# EAGLE design control_board (EAGLE 7.6.0)

## Sheet 1 of 6: Power
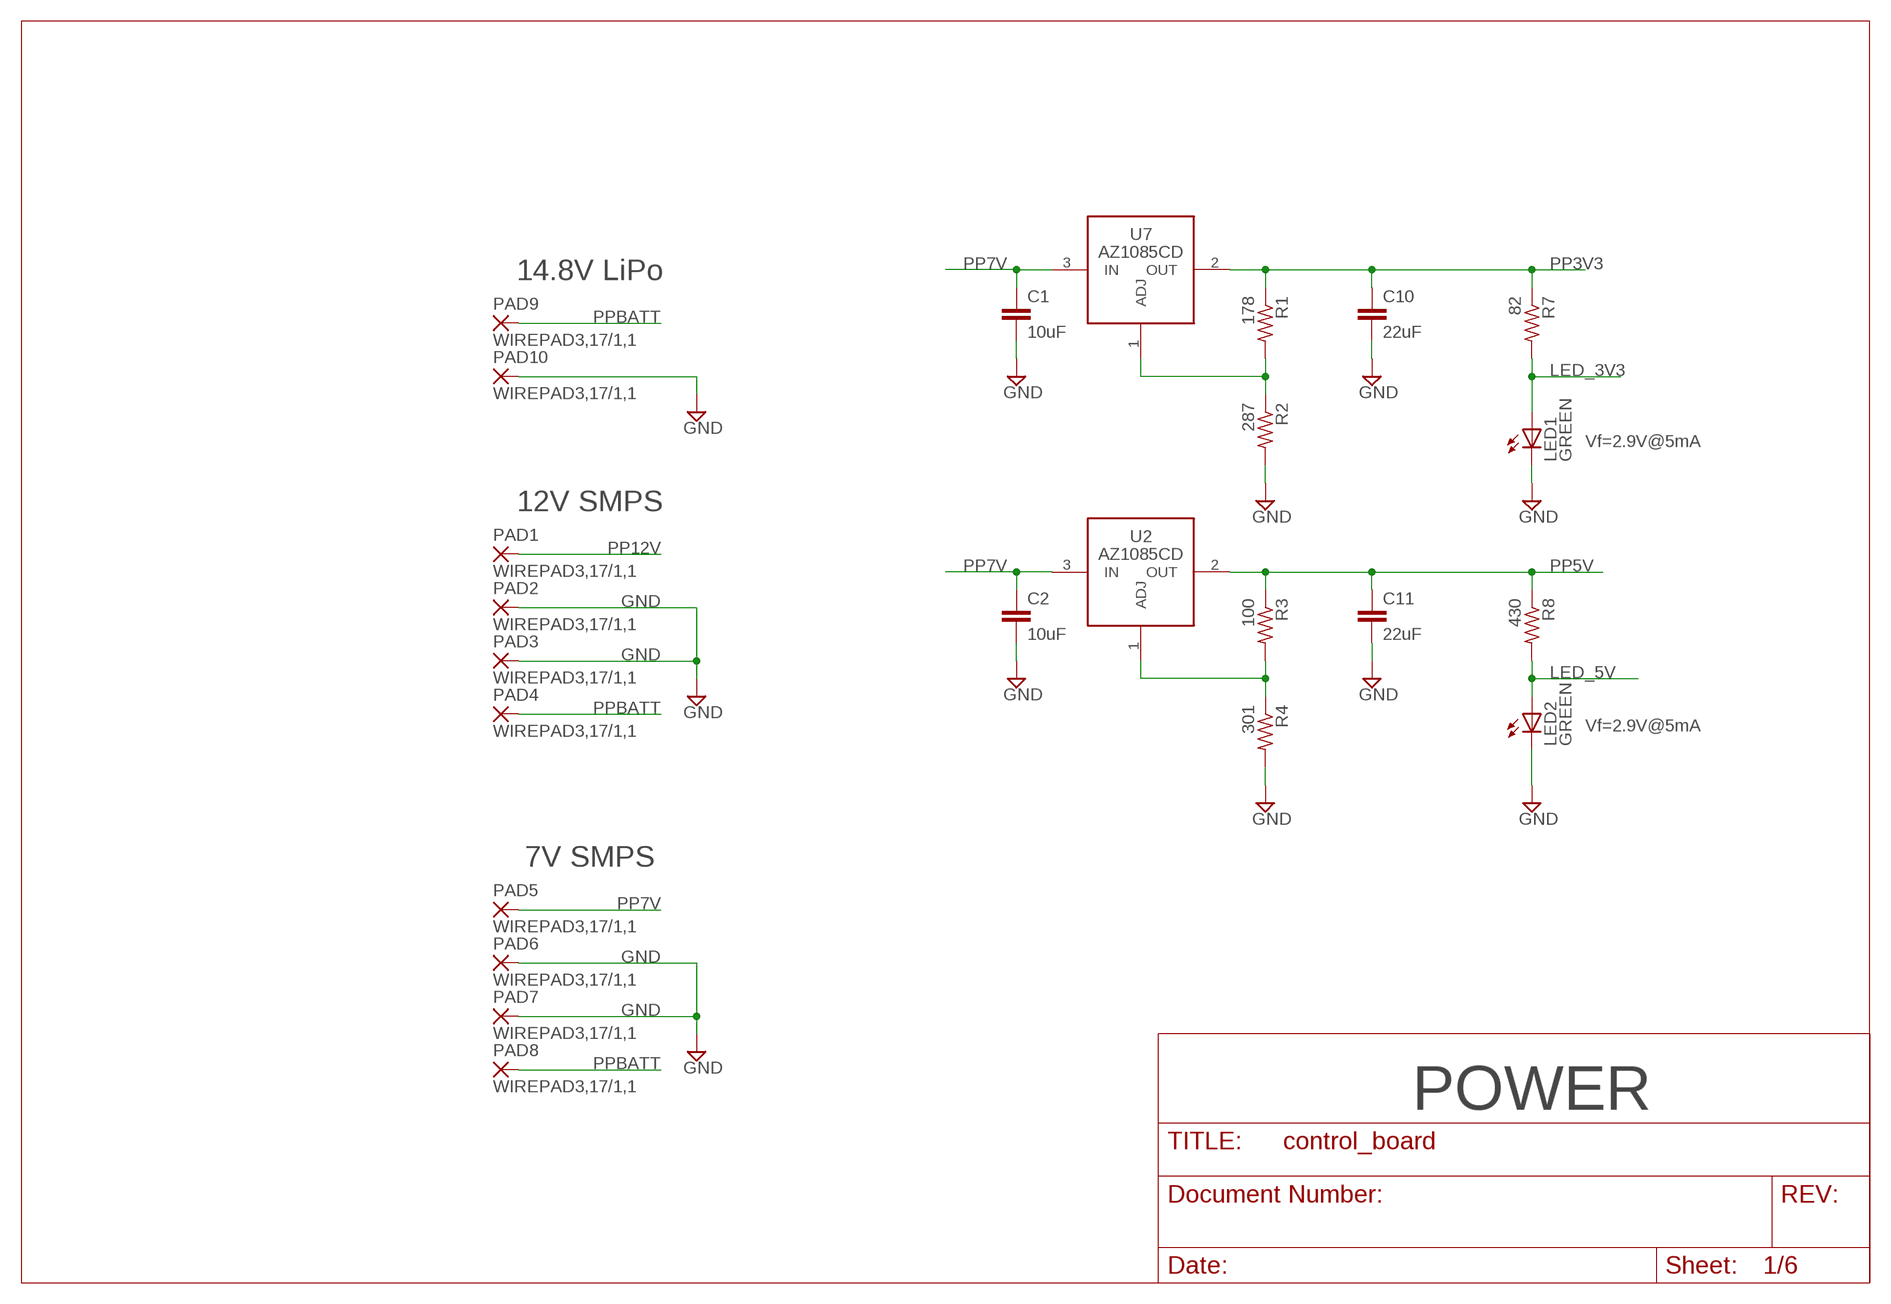
[diagram p0: schematic, sheet 1]

### Parts
C1  10uF  C-EUC0603  [C0603]
C2  10uF  C-EUC0603  [C0603]
C10  22uF  C-EUC0603  [C0603]
C11  22uF  C-EUC0603  [C0603]
LED1  GREEN  LEDCHIPLED_0805  [CHIPLED_0805]
LED2  GREEN  LEDCHIPLED_0805  [CHIPLED_0805]
PAD1  WIREPAD3,17/1,1  [3,17/1,1]
PAD2  WIREPAD3,17/1,1  [3,17/1,1]
PAD3  WIREPAD3,17/1,1  [3,17/1,1]
PAD4  WIREPAD3,17/1,1  [3,17/1,1]
PAD5  WIREPAD3,17/1,1  [3,17/1,1]
PAD6  WIREPAD3,17/1,1  [3,17/1,1]
PAD7  WIREPAD3,17/1,1  [3,17/1,1]
PAD8  WIREPAD3,17/1,1  [3,17/1,1]
PAD9  WIREPAD3,17/1,1  [3,17/1,1]
PAD10  WIREPAD3,17/1,1  [3,17/1,1]
R1  178  R-US_R0603  [R0603]
R2  287  R-US_R0603  [R0603]
R3  100  R-US_R0603  [R0603]
R4  301  R-US_R0603  [R0603]
R7  82  R-US_R0603  [R0603]
R8  430  R-US_R0603  [R0603]
U2  AZ1085CD  AZ1085C  [TO252]
U7  AZ1085CD  AZ1085C  [TO252]

### Nets
GND: C1.2 C2.2 C10.2 C11.2 LED1.C LED2.C PAD2.1(P) PAD3.1(P) PAD6.1(P) PAD7.1(P) PAD10.1(P) R2.2 R4.2 ; also sheet 2,3,4,5,6
LED_3V3: LED1.A R7.2
LED_5V: LED2.A R8.2
N$1: R3.2 R4.1 U2.1(ADJ)
N$3: R1.2 R2.1 U7.1(ADJ)
PP3V3: C10.1 R1.1 R7.1 U7.2(OUT) ; also sheet 3,4,5
PP5V: C11.1 R3.1 R8.1 U2.2(OUT) ; also sheet 3,6
PP7V: C1.1 C2.1 PAD5.1(P) U2.3(IN) U7.3(IN) ; also sheet 2
PP12V: PAD1.1(P) ; also sheet 6
PPBATT: PAD4.1(P) PAD8.1(P) PAD9.1(P)

### Notes on the sheet
- 14.8V LiPo
- Vf=2.9V@5mA
- 12V SMPS
- Vf=2.9V@5mA
- 7V SMPS
- POWER

## Sheet 2 of 6: Nucleo
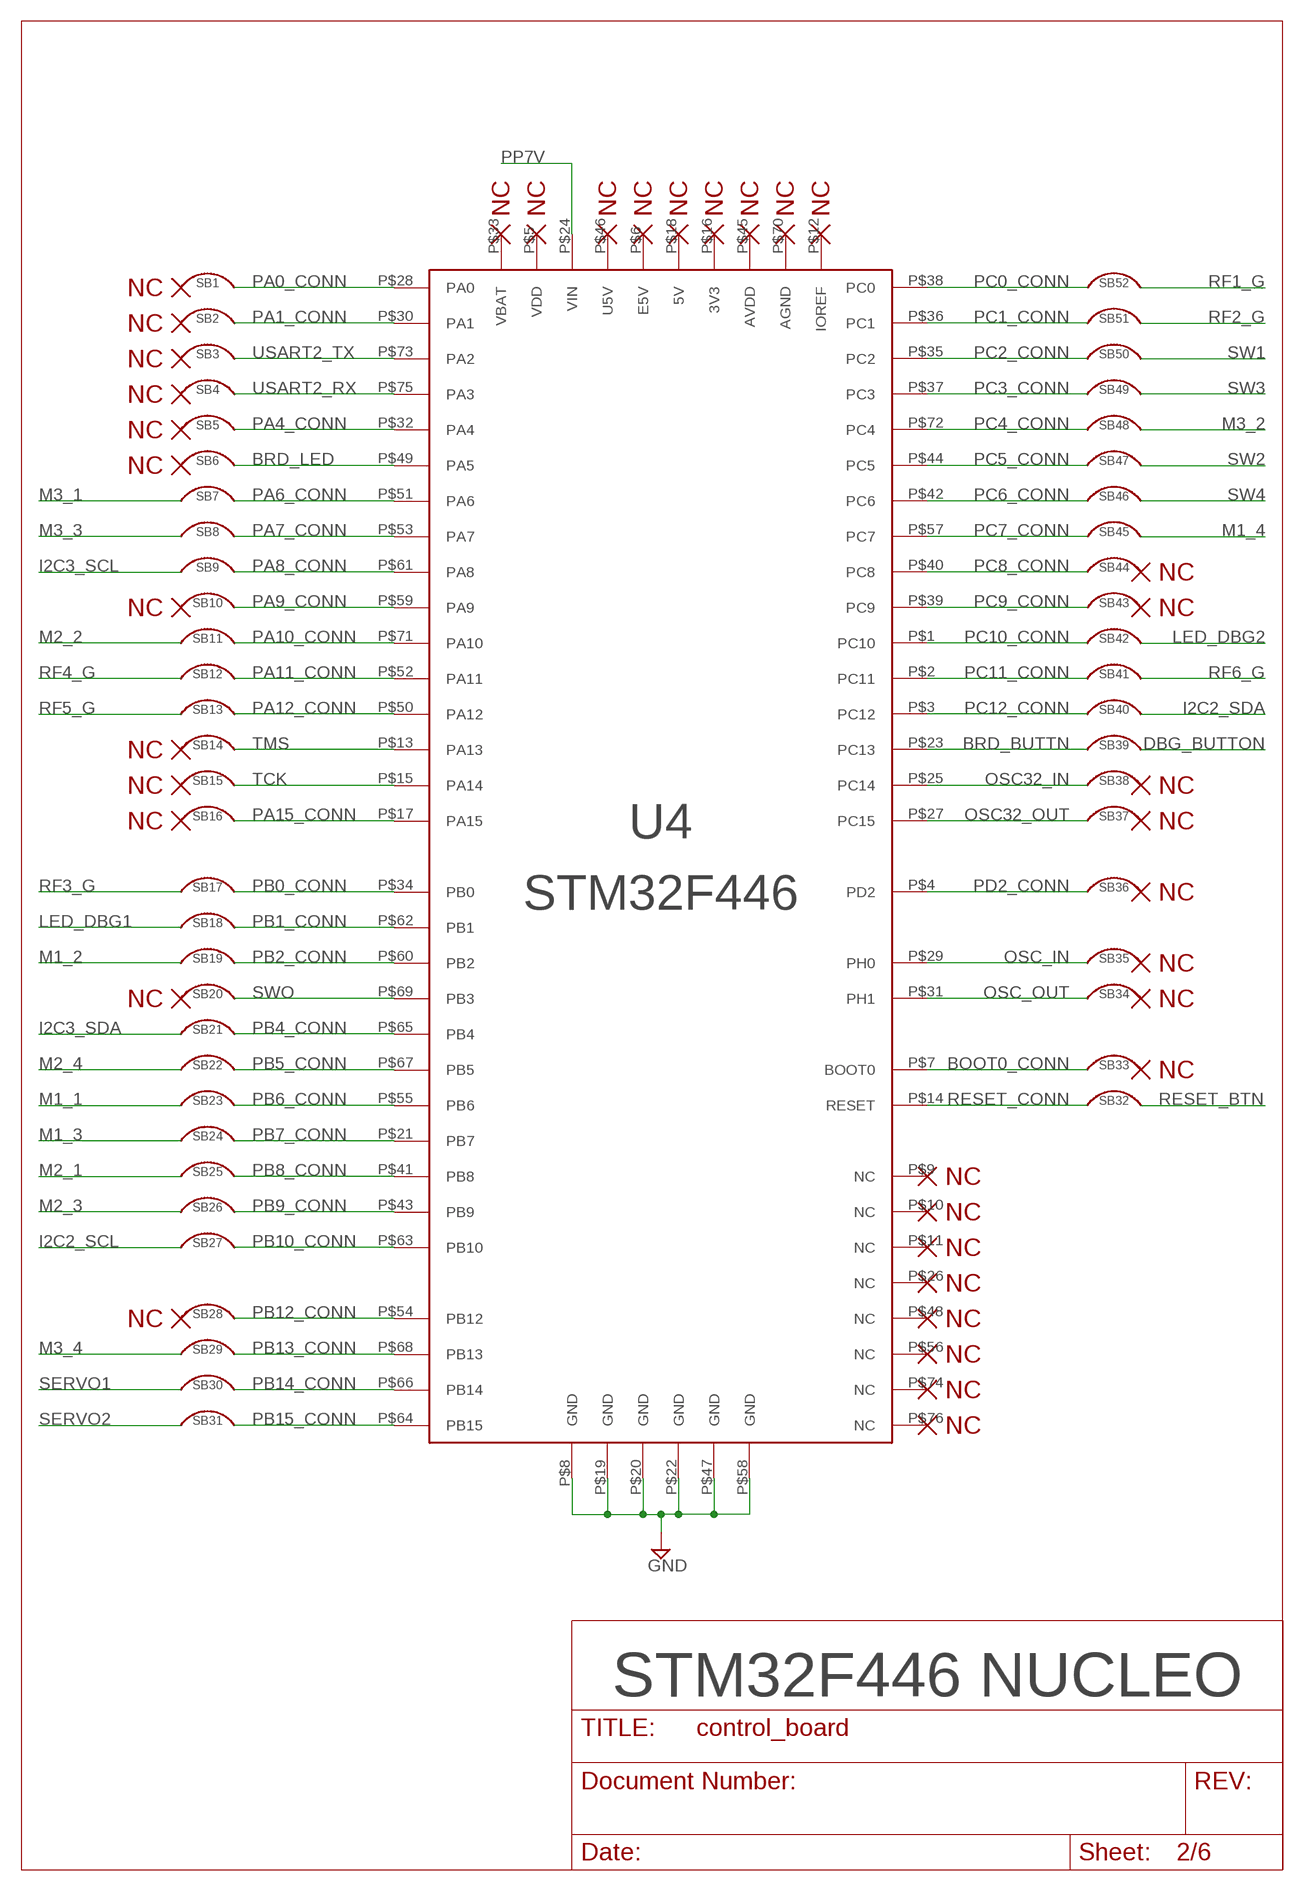
[diagram p1: schematic, sheet 2]

### Parts
SB1  SOLDER_BRIDGE  [SOLDER_BRIDGE]
SB2  SOLDER_BRIDGE  [SOLDER_BRIDGE]
SB3  SOLDER_BRIDGE  [SOLDER_BRIDGE]
SB4  SOLDER_BRIDGE  [SOLDER_BRIDGE]
SB5  SOLDER_BRIDGE  [SOLDER_BRIDGE]
SB6  SOLDER_BRIDGE  [SOLDER_BRIDGE]
SB7  SOLDER_BRIDGE  [SOLDER_BRIDGE]
SB8  SOLDER_BRIDGE  [SOLDER_BRIDGE]
SB9  SOLDER_BRIDGE  [SOLDER_BRIDGE]
SB10  SOLDER_BRIDGE  [SOLDER_BRIDGE]
SB11  SOLDER_BRIDGE  [SOLDER_BRIDGE]
SB12  SOLDER_BRIDGE  [SOLDER_BRIDGE]
SB13  SOLDER_BRIDGE  [SOLDER_BRIDGE]
SB14  SOLDER_BRIDGE  [SOLDER_BRIDGE]
SB15  SOLDER_BRIDGE  [SOLDER_BRIDGE]
SB16  SOLDER_BRIDGE  [SOLDER_BRIDGE]
SB17  SOLDER_BRIDGE  [SOLDER_BRIDGE]
SB18  SOLDER_BRIDGE  [SOLDER_BRIDGE]
SB19  SOLDER_BRIDGE  [SOLDER_BRIDGE]
SB20  SOLDER_BRIDGE  [SOLDER_BRIDGE]
SB21  SOLDER_BRIDGE  [SOLDER_BRIDGE]
SB22  SOLDER_BRIDGE  [SOLDER_BRIDGE]
SB23  SOLDER_BRIDGE  [SOLDER_BRIDGE]
SB24  SOLDER_BRIDGE  [SOLDER_BRIDGE]
SB25  SOLDER_BRIDGE  [SOLDER_BRIDGE]
SB26  SOLDER_BRIDGE  [SOLDER_BRIDGE]
SB27  SOLDER_BRIDGE  [SOLDER_BRIDGE]
SB28  SOLDER_BRIDGE  [SOLDER_BRIDGE]
SB29  SOLDER_BRIDGE  [SOLDER_BRIDGE]
SB30  SOLDER_BRIDGE  [SOLDER_BRIDGE]
SB31  SOLDER_BRIDGE  [SOLDER_BRIDGE]
SB32  SOLDER_BRIDGE  [SOLDER_BRIDGE]
SB33  SOLDER_BRIDGE  [SOLDER_BRIDGE]
SB34  SOLDER_BRIDGE  [SOLDER_BRIDGE]
SB35  SOLDER_BRIDGE  [SOLDER_BRIDGE]
SB36  SOLDER_BRIDGE  [SOLDER_BRIDGE]
SB37  SOLDER_BRIDGE  [SOLDER_BRIDGE]
SB38  SOLDER_BRIDGE  [SOLDER_BRIDGE]
SB39  SOLDER_BRIDGE  [SOLDER_BRIDGE]
SB40  SOLDER_BRIDGE  [SOLDER_BRIDGE]
SB41  SOLDER_BRIDGE  [SOLDER_BRIDGE]
SB42  SOLDER_BRIDGE  [SOLDER_BRIDGE]
SB43  SOLDER_BRIDGE  [SOLDER_BRIDGE]
SB44  SOLDER_BRIDGE  [SOLDER_BRIDGE]
SB45  SOLDER_BRIDGE  [SOLDER_BRIDGE]
SB46  SOLDER_BRIDGE  [SOLDER_BRIDGE]
SB47  SOLDER_BRIDGE  [SOLDER_BRIDGE]
SB48  SOLDER_BRIDGE  [SOLDER_BRIDGE]
SB49  SOLDER_BRIDGE  [SOLDER_BRIDGE]
SB50  SOLDER_BRIDGE  [SOLDER_BRIDGE]
SB51  SOLDER_BRIDGE  [SOLDER_BRIDGE]
SB52  SOLDER_BRIDGE  [SOLDER_BRIDGE]
U4  STM32F446  NUCLEO  [NUCLEO]
U$2  NC  (no package)
U$3  NC  (no package)
U$4  NC  (no package)
U$5  NC  (no package)
U$6  NC  (no package)
U$7  NC  (no package)
U$8  NC  (no package)
U$9  NC  (no package)
U$10  NC  (no package)
U$11  NC  (no package)
U$12  NC  (no package)
U$13  NC  (no package)
U$14  NC  (no package)
U$15  NC  (no package)
U$16  NC  (no package)
U$17  NC  (no package)
U$18  NC  (no package)
U$19  NC  (no package)
U$20  NC  (no package)
U$21  NC  (no package)
U$22  NC  (no package)
U$23  NC  (no package)
U$24  NC  (no package)
U$25  NC  (no package)
U$26  NC  (no package)
U$27  NC  (no package)
U$28  NC  (no package)
U$29  NC  (no package)
U$32  NC  (no package)
U$33  NC  (no package)
U$34  NC  (no package)
U$35  NC  (no package)
U$36  NC  (no package)
U$37  NC  (no package)
U$38  NC  (no package)
U$39  NC  (no package)
U$40  NC  (no package)

### Nets
BOOT0_CONN: SB33.P$1 U4.P$7(BOOT0)
BRD_BUTTN: SB39.P$1 U4.P$23(PC13)
BRD_LED: SB6.P$2 U4.P$49(PA5)
DBG_BUTTON: SB39.P$2 ; also sheet 3
GND: U4.P$8(GND) U4.P$19(GND) U4.P$20(GND) U4.P$22(GND) U4.P$47(GND) U4.P$58(GND) ; also sheet 1,3,4,5,6
I2C2_SCL: SB27.P$1 ; also sheet 4,5
I2C2_SDA: SB40.P$2 ; also sheet 4,5
I2C3_SCL: SB9.P$1 ; also sheet 4,5
I2C3_SDA: SB21.P$1 ; also sheet 4,5
LED_DBG1: SB18.P$1 ; also sheet 3
LED_DBG2: SB42.P$2 ; also sheet 3
M1_1: SB23.P$1 ; also sheet 6
M1_2: SB19.P$1 ; also sheet 6
M1_3: SB24.P$1 ; also sheet 6
M1_4: SB45.P$1 ; also sheet 6
M2_1: SB25.P$1 ; also sheet 6
M2_2: SB11.P$1 ; also sheet 6
M2_3: SB26.P$1 ; also sheet 6
M2_4: SB22.P$1 ; also sheet 6
M3_1: SB7.P$1 ; also sheet 6
M3_2: SB48.P$2 ; also sheet 6
M3_3: SB8.P$1 ; also sheet 6
M3_4: SB29.P$1 ; also sheet 6
N$2: U4.P$9(NC) U$2.P$1
N$4: U4.P$10(NC) U$3.P$1
N$5: U4.P$11(NC) U$4.P$1
N$6: U4.P$26(NC) U$5.P$1
N$7: U4.P$48(NC) U$6.P$1
N$8: U4.P$56(NC) U$7.P$1
N$9: U4.P$74(NC) U$8.P$1
N$10: U4.P$76(NC) U$9.P$1
N$11: U4.P$46(U5V) U$10.P$1
N$12: U4.P$6(E5V) U$11.P$1
N$13: U4.P$45(AVDD) U$12.P$1
N$14: U4.P$70(AGND) U$13.P$1
N$15: U4.P$12(IOREF) U$14.P$1
N$16: U4.P$33(VBAT) U$15.P$1
N$17: U4.P$5(VDD) U$16.P$1
N$18: U4.P$18(5V) U$17.P$1
N$19: U4.P$16(3V3) U$18.P$1
N$20: SB1.P$1 U$35.P$1
N$21: SB2.P$1 U$36.P$1
N$22: SB3.P$1 U$21.P$1
N$23: SB4.P$1 U$22.P$1
N$24: SB5.P$1 U$39.P$1
N$25: SB6.P$1 U$26.P$1
N$26: SB10.P$1 U$27.P$1
N$27: SB14.P$1 U$23.P$1
N$28: SB15.P$1 U$24.P$1
N$29: SB16.P$1 U$28.P$1
N$30: SB20.P$1 U$25.P$1
N$31: SB28.P$1 U$38.P$1
N$32: SB35.P$2 U$32.P$1
N$33: SB34.P$2 U$33.P$1
N$34: SB33.P$2 U$29.P$1
N$35: SB36.P$2 U$34.P$1
N$36: SB37.P$2 U$20.P$1
N$37: SB38.P$2 U$19.P$1
N$38: SB43.P$1 U$40.P$1
N$39: SB44.P$2 U$37.P$1
OSC32_IN: SB38.P$1 U4.P$25(PC14)
OSC32_OUT: SB37.P$1 U4.P$27(PC15)
OSC_IN: SB35.P$1 U4.P$29(PH0)
OSC_OUT: SB34.P$1 U4.P$31(PH1)
PA0_CONN: SB1.P$2 U4.P$28(PA0)
PA1_CONN: SB2.P$2 U4.P$30(PA1)
PA4_CONN: SB5.P$2 U4.P$32(PA4)
PA6_CONN: SB7.P$2 U4.P$51(PA6)
PA7_CONN: SB8.P$2 U4.P$53(PA7)
PA8_CONN: SB9.P$2 U4.P$61(PA8)
PA9_CONN: SB10.P$2 U4.P$59(PA9)
PA10_CONN: SB11.P$2 U4.P$71(PA10)
PA11_CONN: SB12.P$2 U4.P$52(PA11)
PA12_CONN: SB13.P$2 U4.P$50(PA12)
PA15_CONN: SB16.P$2 U4.P$17(PA15)
PB0_CONN: SB17.P$2 U4.P$34(PB0)
PB1_CONN: SB18.P$2 U4.P$62(PB1)
PB2_CONN: SB19.P$2 U4.P$60(PB2)
PB4_CONN: SB21.P$2 U4.P$65(PB4)
PB5_CONN: SB22.P$2 U4.P$67(PB5)
PB6_CONN: SB23.P$2 U4.P$55(PB6)
PB7_CONN: SB24.P$2 U4.P$21(PB7)
PB8_CONN: SB25.P$2 U4.P$41(PB8)
PB9_CONN: SB26.P$2 U4.P$43(PB9)
PB10_CONN: SB27.P$2 U4.P$63(PB10)
PB12_CONN: SB28.P$2 U4.P$54(PB12)
PB13_CONN: SB29.P$2 U4.P$68(PB13)
PB14_CONN: SB30.P$2 U4.P$66(PB14)
PB15_CONN: SB31.P$2 U4.P$64(PB15)
PC0_CONN: SB52.P$2 U4.P$38(PC0)
PC1_CONN: SB51.P$2 U4.P$36(PC1)
PC2_CONN: SB50.P$1 U4.P$35(PC2)
PC3_CONN: SB49.P$1 U4.P$37(PC3)
PC4_CONN: SB48.P$1 U4.P$72(PC4)
PC5_CONN: SB47.P$1 U4.P$44(PC5)
PC6_CONN: SB46.P$1 U4.P$42(PC6)
PC7_CONN: SB45.P$2 U4.P$57(PC7)
PC8_CONN: SB44.P$1 U4.P$40(PC8)
PC9_CONN: SB43.P$2 U4.P$39(PC9)
PC10_CONN: SB42.P$1 U4.P$1(PC10)
PC11_CONN: SB41.P$1 U4.P$2(PC11)
PC12_CONN: SB40.P$1 U4.P$3(PC12)
PD2_CONN: SB36.P$1 U4.P$4(PD2)
PP7V: U4.P$24(VIN) ; also sheet 1
RESET_BTN: SB32.P$2 ; also sheet 3
RESET_CONN: SB32.P$1 U4.P$14(RESET)
RF1_G: SB52.P$1 ; also sheet 4
RF2_G: SB51.P$1 ; also sheet 4
RF3_G: SB17.P$1 ; also sheet 4
RF4_G: SB12.P$1 ; also sheet 4
RF5_G: SB13.P$1 ; also sheet 4
RF6_G: SB41.P$2 ; also sheet 4
SERVO1: SB30.P$1 ; also sheet 6
SERVO2: SB31.P$1 ; also sheet 6
SW1: SB50.P$2 ; also sheet 3
SW2: SB47.P$2 ; also sheet 3
SW3: SB49.P$2 ; also sheet 3
SW4: SB46.P$2 ; also sheet 3
SWO: SB20.P$2 U4.P$69(PB3)
TCK: SB15.P$2 U4.P$15(PA14)
TMS: SB14.P$2 U4.P$13(PA13)
USART2_RX: SB4.P$2 U4.P$75(PA3)
USART2_TX: SB3.P$2 U4.P$73(PA2)

### Notes on the sheet
- STM32F446 NUCLEO

## Sheet 3 of 6: Switches and LEDs
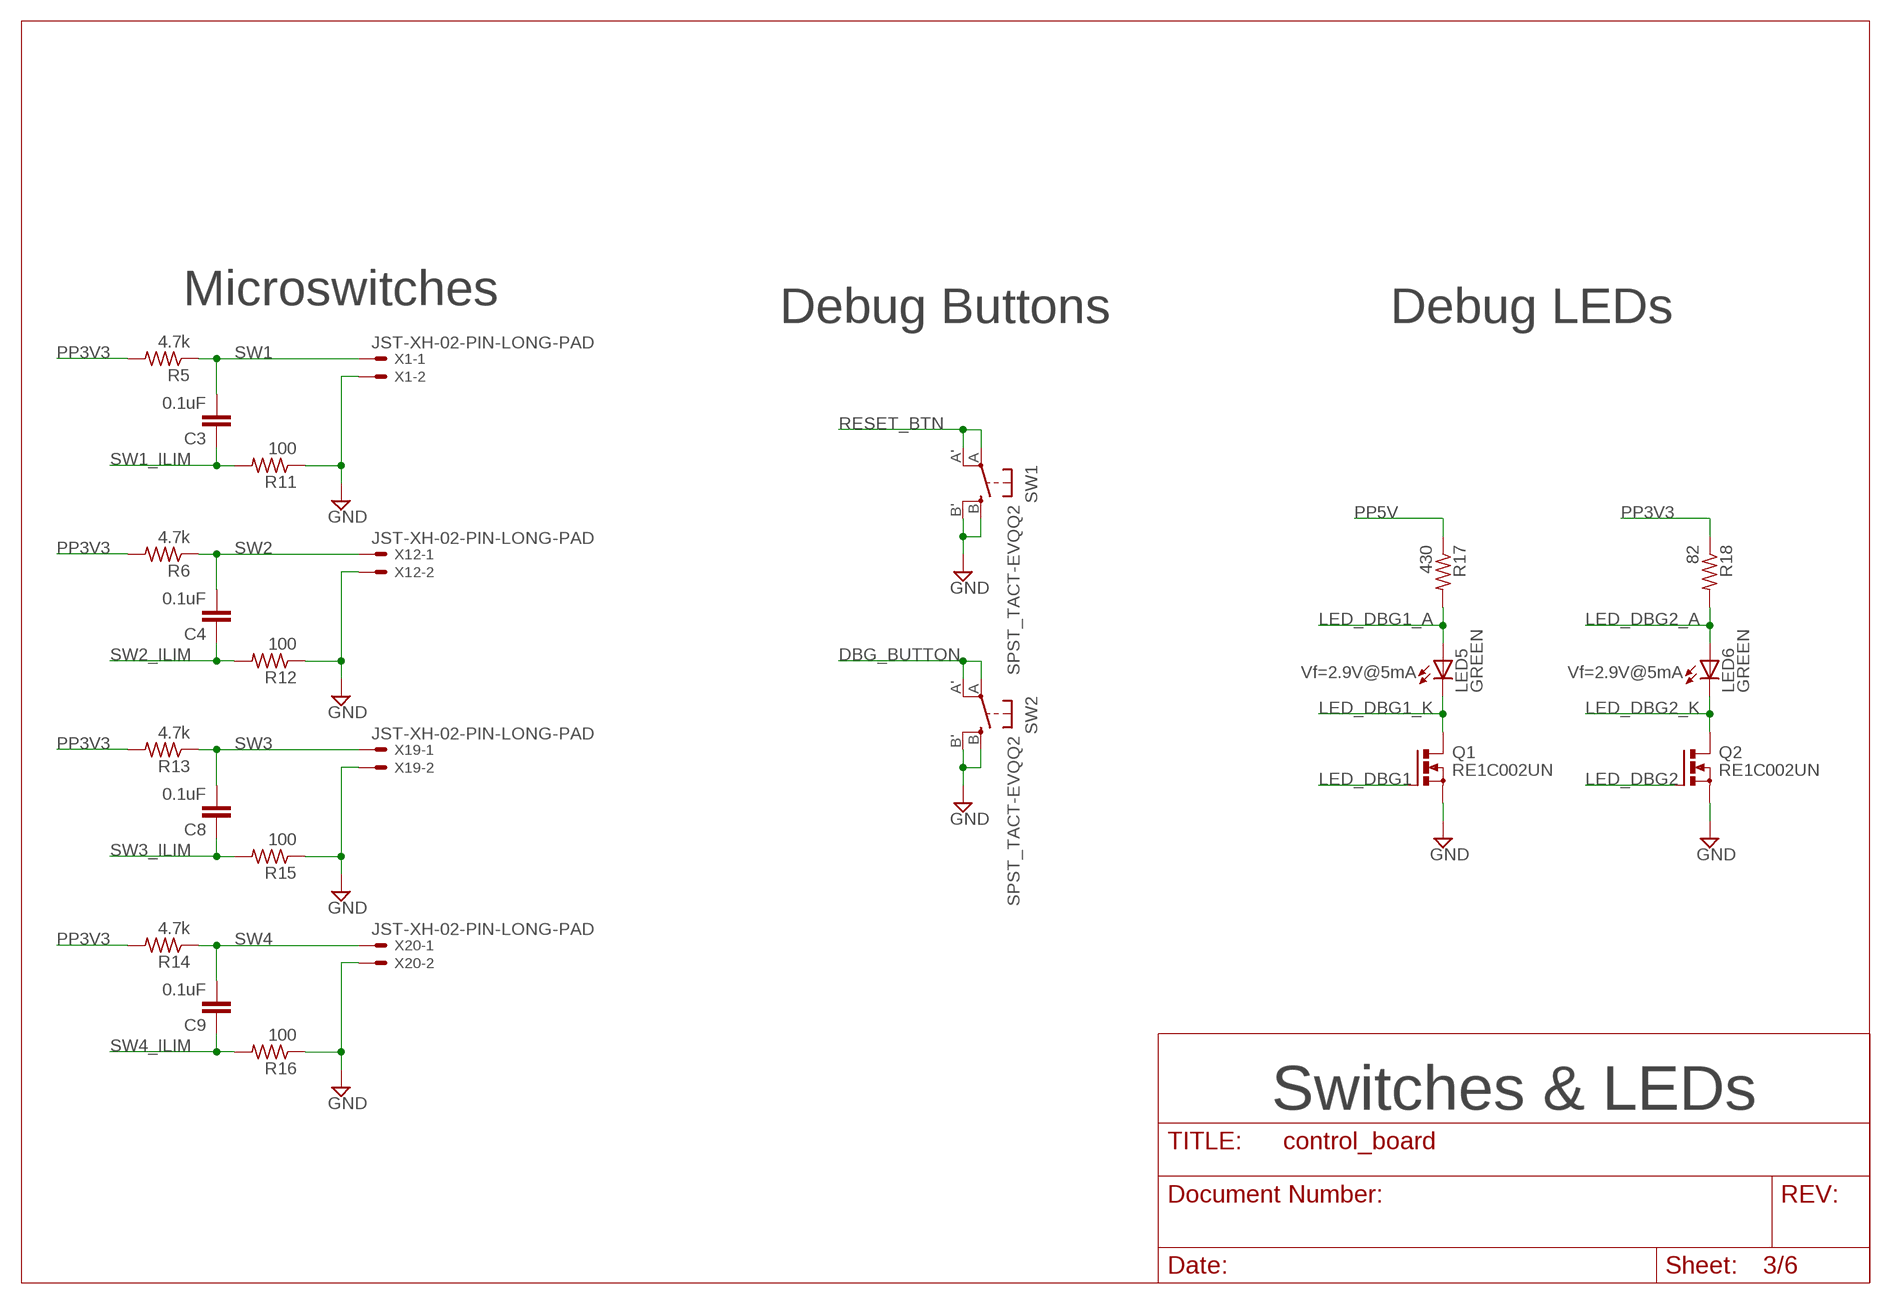
[diagram p2: schematic, sheet 3]

### Parts
C3  0.1uF  C-EUC0603  [C0603]
C4  0.1uF  C-EUC0603  [C0603]
C8  0.1uF  C-EUC0603  [C0603]
C9  0.1uF  C-EUC0603  [C0603]
LED5  GREEN  LEDCHIPLED_0805  [CHIPLED_0805]
LED6  GREEN  LEDCHIPLED_0805  [CHIPLED_0805]
Q1  RE1C002UN  [SOT416FL]
Q2  RE1C002UN  [SOT416FL]
R5  4.7k  R-US_R0603  [R0603]
R6  4.7k  R-US_R0603  [R0603]
R11  100  R-US_R0603  [R0603]
R12  100  R-US_R0603  [R0603]
R13  4.7k  R-US_R0603  [R0603]
R14  4.7k  R-US_R0603  [R0603]
R15  100  R-US_R0603  [R0603]
R16  100  R-US_R0603  [R0603]
R17  430  R-US_R0603  [R0603]
R18  82  R-US_R0603  [R0603]
SW1  SPST_TACT-EVQQ2  [EVQ-Q2]
SW2  SPST_TACT-EVQQ2  [EVQ-Q2]
X1  JST-XH-02-PIN-LONG-PAD  [JST-XH-02-PACKAGE-LONG-PAD]
X12  JST-XH-02-PIN-LONG-PAD  [JST-XH-02-PACKAGE-LONG-PAD]
X19  JST-XH-02-PIN-LONG-PAD  [JST-XH-02-PACKAGE-LONG-PAD]
X20  JST-XH-02-PIN-LONG-PAD  [JST-XH-02-PACKAGE-LONG-PAD]

### Nets
DBG_BUTTON: SW2.A'(P1) SW2.A(P) ; also sheet 2
GND: Q1.P$2(S) Q2.P$2(S) R11.1 R12.1 R15.1 R16.1 SW1.B'(S1) SW1.B(S) SW2.B'(S1) SW2.B(S) X1.2 X12.2 X19.2 X20.2 ; also sheet 1,2,4,5,6
LED_DBG1: Q1.P$1(G) ; also sheet 2
LED_DBG1_A: LED5.A R17.2
LED_DBG1_K: LED5.C Q1.P$3(D)
LED_DBG2: Q2.P$1(G) ; also sheet 2
LED_DBG2_A: LED6.A R18.2
LED_DBG2_K: LED6.C Q2.P$3(D)
PP3V3: R5.2 R6.2 R13.2 R14.2 R18.1 ; also sheet 1,4,5
PP5V: R17.1 ; also sheet 1,6
RESET_BTN: SW1.A'(P1) SW1.A(P) ; also sheet 2
SW1: C3.2 R5.1 X1.1 ; also sheet 2
SW1_ILIM: C3.1 R11.2
SW2: C4.2 R6.1 X12.1 ; also sheet 2
SW2_ILIM: C4.1 R12.2
SW3: C8.2 R13.1 X19.1 ; also sheet 2
SW3_ILIM: C8.1 R15.2
SW4: C9.2 R14.1 X20.1 ; also sheet 2
SW4_ILIM: C9.1 R16.2

### Notes on the sheet
- Microswitches
- Debug Buttons | Debug LEDs
- Vf=2.9V@5mA | Vf=2.9V@5mA
- Switches & LEDs

## Sheet 4 of 6: Sensors
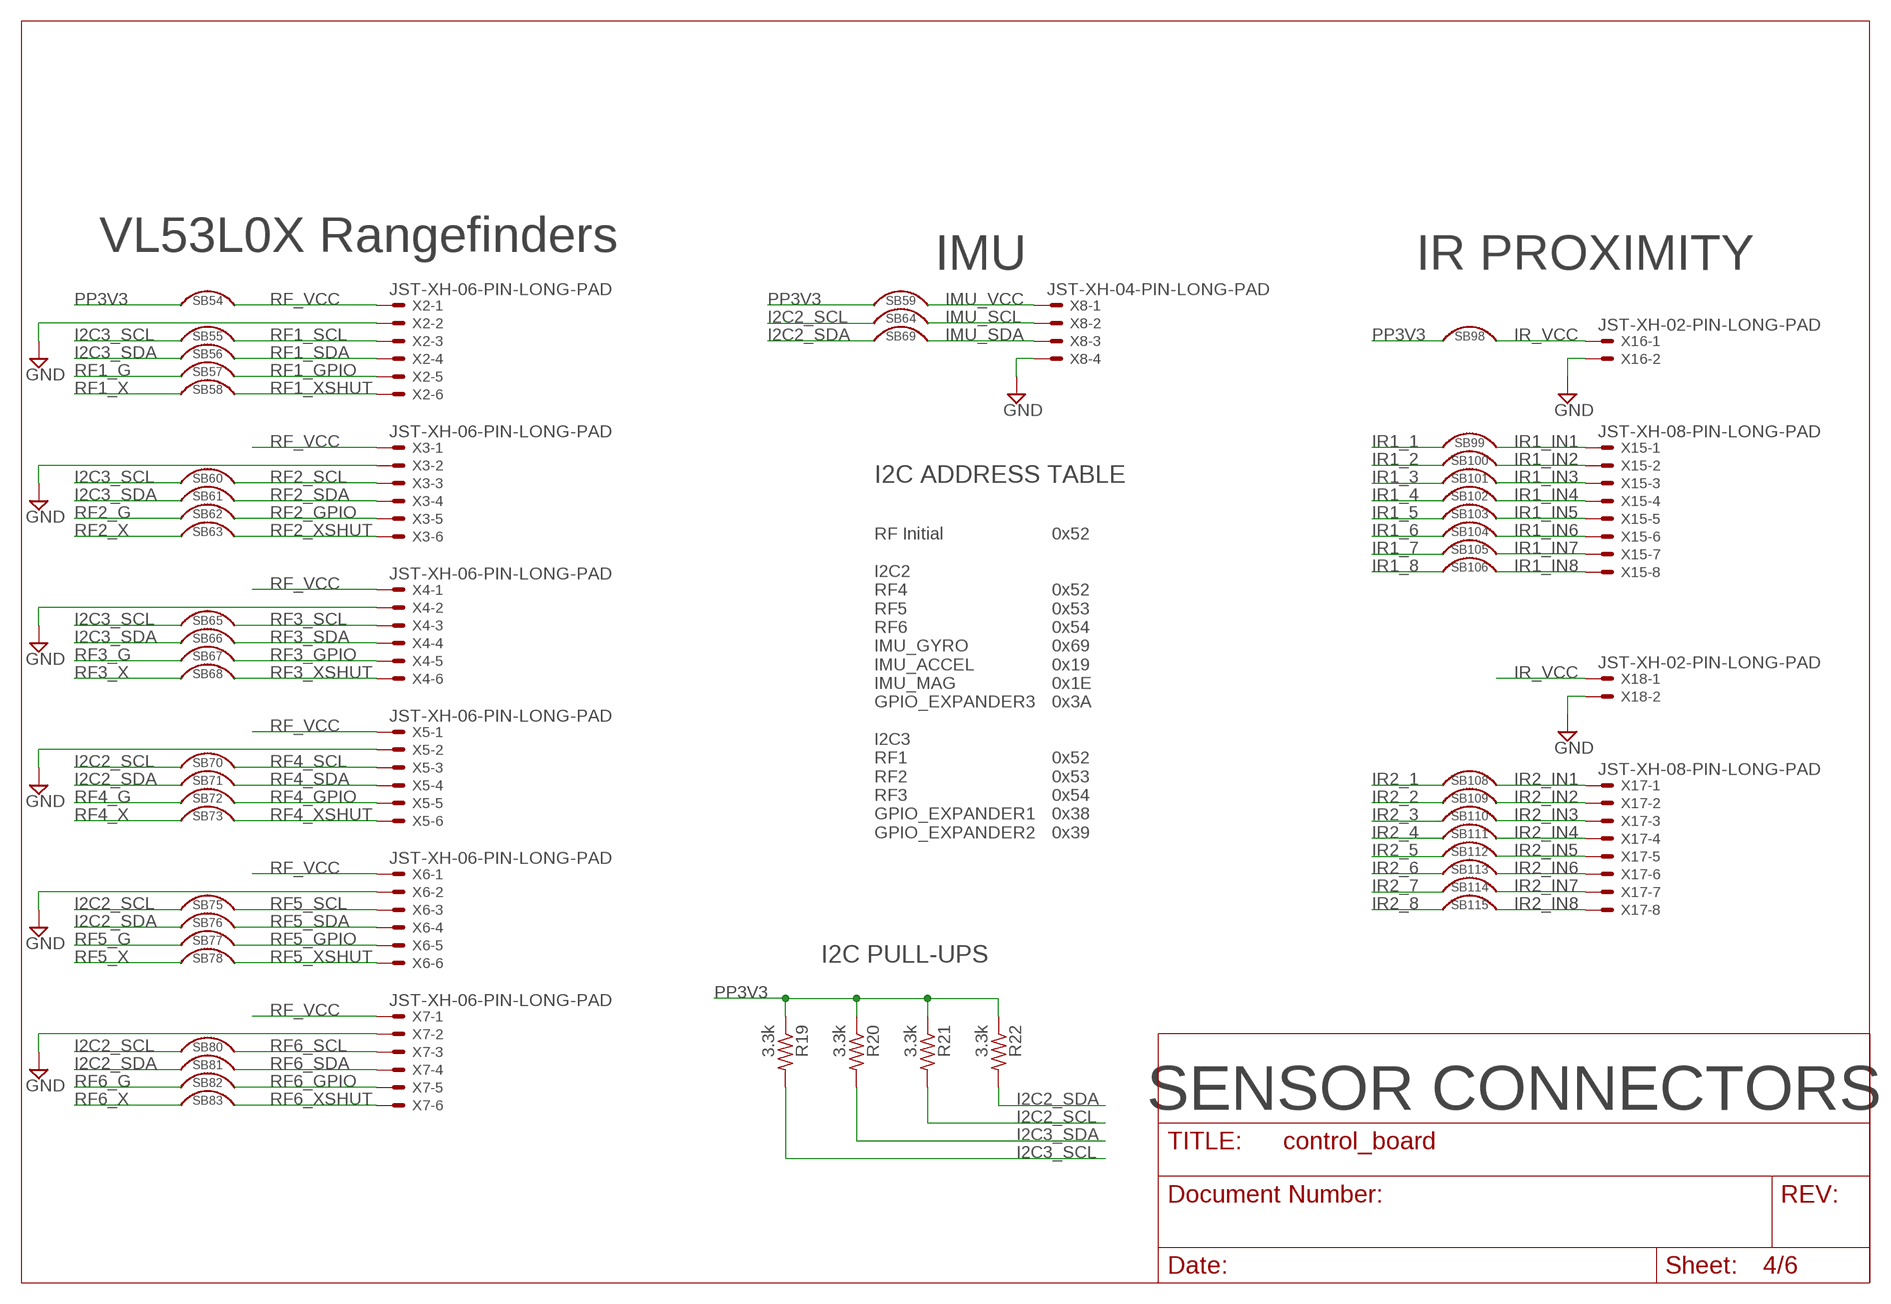
[diagram p3: schematic, sheet 4]

### Parts
R19  3.3k  R-US_R0603  [R0603]
R20  3.3k  R-US_R0603  [R0603]
R21  3.3k  R-US_R0603  [R0603]
R22  3.3k  R-US_R0603  [R0603]
SB54  SOLDER_BRIDGE  [SOLDER_BRIDGE]
SB55  SOLDER_BRIDGE  [SOLDER_BRIDGE]
SB56  SOLDER_BRIDGE  [SOLDER_BRIDGE]
SB57  SOLDER_BRIDGE  [SOLDER_BRIDGE]
SB58  SOLDER_BRIDGE  [SOLDER_BRIDGE]
SB59  SOLDER_BRIDGE  [SOLDER_BRIDGE]
SB60  SOLDER_BRIDGE  [SOLDER_BRIDGE]
SB61  SOLDER_BRIDGE  [SOLDER_BRIDGE]
SB62  SOLDER_BRIDGE  [SOLDER_BRIDGE]
SB63  SOLDER_BRIDGE  [SOLDER_BRIDGE]
SB64  SOLDER_BRIDGE  [SOLDER_BRIDGE]
SB65  SOLDER_BRIDGE  [SOLDER_BRIDGE]
SB66  SOLDER_BRIDGE  [SOLDER_BRIDGE]
SB67  SOLDER_BRIDGE  [SOLDER_BRIDGE]
SB68  SOLDER_BRIDGE  [SOLDER_BRIDGE]
SB69  SOLDER_BRIDGE  [SOLDER_BRIDGE]
SB70  SOLDER_BRIDGE  [SOLDER_BRIDGE]
SB71  SOLDER_BRIDGE  [SOLDER_BRIDGE]
SB72  SOLDER_BRIDGE  [SOLDER_BRIDGE]
SB73  SOLDER_BRIDGE  [SOLDER_BRIDGE]
SB75  SOLDER_BRIDGE  [SOLDER_BRIDGE]
SB76  SOLDER_BRIDGE  [SOLDER_BRIDGE]
SB77  SOLDER_BRIDGE  [SOLDER_BRIDGE]
SB78  SOLDER_BRIDGE  [SOLDER_BRIDGE]
SB80  SOLDER_BRIDGE  [SOLDER_BRIDGE]
SB81  SOLDER_BRIDGE  [SOLDER_BRIDGE]
SB82  SOLDER_BRIDGE  [SOLDER_BRIDGE]
SB83  SOLDER_BRIDGE  [SOLDER_BRIDGE]
SB98  SOLDER_BRIDGE  [SOLDER_BRIDGE]
SB99  SOLDER_BRIDGE  [SOLDER_BRIDGE]
SB100  SOLDER_BRIDGE  [SOLDER_BRIDGE]
SB101  SOLDER_BRIDGE  [SOLDER_BRIDGE]
SB102  SOLDER_BRIDGE  [SOLDER_BRIDGE]
SB103  SOLDER_BRIDGE  [SOLDER_BRIDGE]
SB104  SOLDER_BRIDGE  [SOLDER_BRIDGE]
SB105  SOLDER_BRIDGE  [SOLDER_BRIDGE]
SB106  SOLDER_BRIDGE  [SOLDER_BRIDGE]
SB108  SOLDER_BRIDGE  [SOLDER_BRIDGE]
SB109  SOLDER_BRIDGE  [SOLDER_BRIDGE]
SB110  SOLDER_BRIDGE  [SOLDER_BRIDGE]
SB111  SOLDER_BRIDGE  [SOLDER_BRIDGE]
SB112  SOLDER_BRIDGE  [SOLDER_BRIDGE]
SB113  SOLDER_BRIDGE  [SOLDER_BRIDGE]
SB114  SOLDER_BRIDGE  [SOLDER_BRIDGE]
SB115  SOLDER_BRIDGE  [SOLDER_BRIDGE]
X2  JST-XH-06-PIN-LONG-PAD  [JST-XH-06-PACKAGE-LONG-PAD]
X3  JST-XH-06-PIN-LONG-PAD  [JST-XH-06-PACKAGE-LONG-PAD]
X4  JST-XH-06-PIN-LONG-PAD  [JST-XH-06-PACKAGE-LONG-PAD]
X5  JST-XH-06-PIN-LONG-PAD  [JST-XH-06-PACKAGE-LONG-PAD]
X6  JST-XH-06-PIN-LONG-PAD  [JST-XH-06-PACKAGE-LONG-PAD]
X7  JST-XH-06-PIN-LONG-PAD  [JST-XH-06-PACKAGE-LONG-PAD]
X8  JST-XH-04-PIN-LONG-PAD  [JST-XH-04-PACKAGE-LONG-PAD]
X15  JST-XH-08-PIN-LONG-PAD  [JST-XH-08-PACKAGE-LONG-PAD]
X16  JST-XH-02-PIN-LONG-PAD  [JST-XH-02-PACKAGE-LONG-PAD]
X17  JST-XH-08-PIN-LONG-PAD  [JST-XH-08-PACKAGE-LONG-PAD]
X18  JST-XH-02-PIN-LONG-PAD  [JST-XH-02-PACKAGE-LONG-PAD]

### Nets
GND: X2.2 X3.2 X4.2 X5.2 X6.2 X7.2 X8.4 X16.2 X18.2 ; also sheet 1,2,3,5,6
I2C2_SCL: R21.2 SB64.P$1 SB70.P$1 SB75.P$1 SB80.P$1 ; also sheet 2,5
I2C2_SDA: R22.2 SB69.P$1 SB71.P$1 SB76.P$1 SB81.P$1 ; also sheet 2,5
I2C3_SCL: R19.2 SB55.P$1 SB60.P$1 SB65.P$1 ; also sheet 2,5
I2C3_SDA: R20.2 SB56.P$1 SB61.P$1 SB66.P$1 ; also sheet 2,5
IMU_SCL: SB64.P$2 X8.2
IMU_SDA: SB69.P$2 X8.3
IMU_VCC: SB59.P$2 X8.1
IR1_1: SB99.P$1 ; also sheet 5
IR1_2: SB100.P$1 ; also sheet 5
IR1_3: SB101.P$1 ; also sheet 5
IR1_4: SB102.P$1 ; also sheet 5
IR1_5: SB103.P$1 ; also sheet 5
IR1_6: SB104.P$1 ; also sheet 5
IR1_7: SB105.P$1 ; also sheet 5
IR1_8: SB106.P$1 ; also sheet 5
IR1_IN1: SB99.P$2 X15.1
IR1_IN2: SB100.P$2 X15.2
IR1_IN3: SB101.P$2 X15.3
IR1_IN4: SB102.P$2 X15.4
IR1_IN5: SB103.P$2 X15.5
IR1_IN6: SB104.P$2 X15.6
IR1_IN7: SB105.P$2 X15.7
IR1_IN8: SB106.P$2 X15.8
IR2_1: SB108.P$1 ; also sheet 5
IR2_2: SB109.P$1 ; also sheet 5
IR2_3: SB110.P$1 ; also sheet 5
IR2_4: SB111.P$1 ; also sheet 5
IR2_5: SB112.P$1 ; also sheet 5
IR2_6: SB113.P$1 ; also sheet 5
IR2_7: SB114.P$1 ; also sheet 5
IR2_8: SB115.P$1 ; also sheet 5
IR2_IN1: SB108.P$2 X17.1
IR2_IN2: SB109.P$2 X17.2
IR2_IN3: SB110.P$2 X17.3
IR2_IN4: SB111.P$2 X17.4
IR2_IN5: SB112.P$2 X17.5
IR2_IN6: SB113.P$2 X17.6
IR2_IN7: SB114.P$2 X17.7
IR2_IN8: SB115.P$2 X17.8
IR_VCC: SB98.P$2 X16.1 X18.1
PP3V3: R19.1 R20.1 R21.1 R22.1 SB54.P$1 SB59.P$1 SB98.P$1 ; also sheet 1,3,5
RF1_G: SB57.P$1 ; also sheet 2
RF1_GPIO: SB57.P$2 X2.5
RF1_SCL: SB55.P$2 X2.3
RF1_SDA: SB56.P$2 X2.4
RF1_X: SB58.P$1 ; also sheet 5
RF1_XSHUT: SB58.P$2 X2.6
RF2_G: SB62.P$1 ; also sheet 2
RF2_GPIO: SB62.P$2 X3.5
RF2_SCL: SB60.P$2 X3.3
RF2_SDA: SB61.P$2 X3.4
RF2_X: SB63.P$1 ; also sheet 5
RF2_XSHUT: SB63.P$2 X3.6
RF3_G: SB67.P$1 ; also sheet 2
RF3_GPIO: SB67.P$2 X4.5
RF3_SCL: SB65.P$2 X4.3
RF3_SDA: SB66.P$2 X4.4
RF3_X: SB68.P$1 ; also sheet 5
RF3_XSHUT: SB68.P$2 X4.6
RF4_G: SB72.P$1 ; also sheet 2
RF4_GPIO: SB72.P$2 X5.5
RF4_SCL: SB70.P$2 X5.3
RF4_SDA: SB71.P$2 X5.4
RF4_X: SB73.P$1 ; also sheet 5
RF4_XSHUT: SB73.P$2 X5.6
RF5_G: SB77.P$1 ; also sheet 2
RF5_GPIO: SB77.P$2 X6.5
RF5_SCL: SB75.P$2 X6.3
RF5_SDA: SB76.P$2 X6.4
RF5_X: SB78.P$1 ; also sheet 5
RF5_XSHUT: SB78.P$2 X6.6
RF6_G: SB82.P$1 ; also sheet 2
RF6_GPIO: SB82.P$2 X7.5
RF6_SCL: SB80.P$2 X7.3
RF6_SDA: SB81.P$2 X7.4
RF6_X: SB83.P$1 ; also sheet 5
RF6_XSHUT: SB83.P$2 X7.6
RF_VCC: SB54.P$2 X2.1 X3.1 X4.1 X5.1 X6.1 X7.1

### Notes on the sheet
- VL53L0X Rangefinders
- IMU | IR PROXIMITY
- I2C ADDRESS TABLE
- RF Initial
  
  I2C2
  RF4
  RF5
  RF6
  IMU_GYRO
  IMU_ACCEL
  IMU_MAG
  GPIO_EXPANDER3
  
  I2C3
  RF1
  RF2
  RF3
  GPIO_EXPANDER1
  GPIO_EXPANDER2
- 0x52
  
  
  0x52
  0x53
  0x54
  0x69
  0x19
  0x1E
  0x3A
  
  
  0x52
  0x53
  0x54
  0x38
  0x39
- I2C PULL-UPS
- SENSOR CONNECTORS

## Sheet 5 of 6: GPIO EXPANDERS
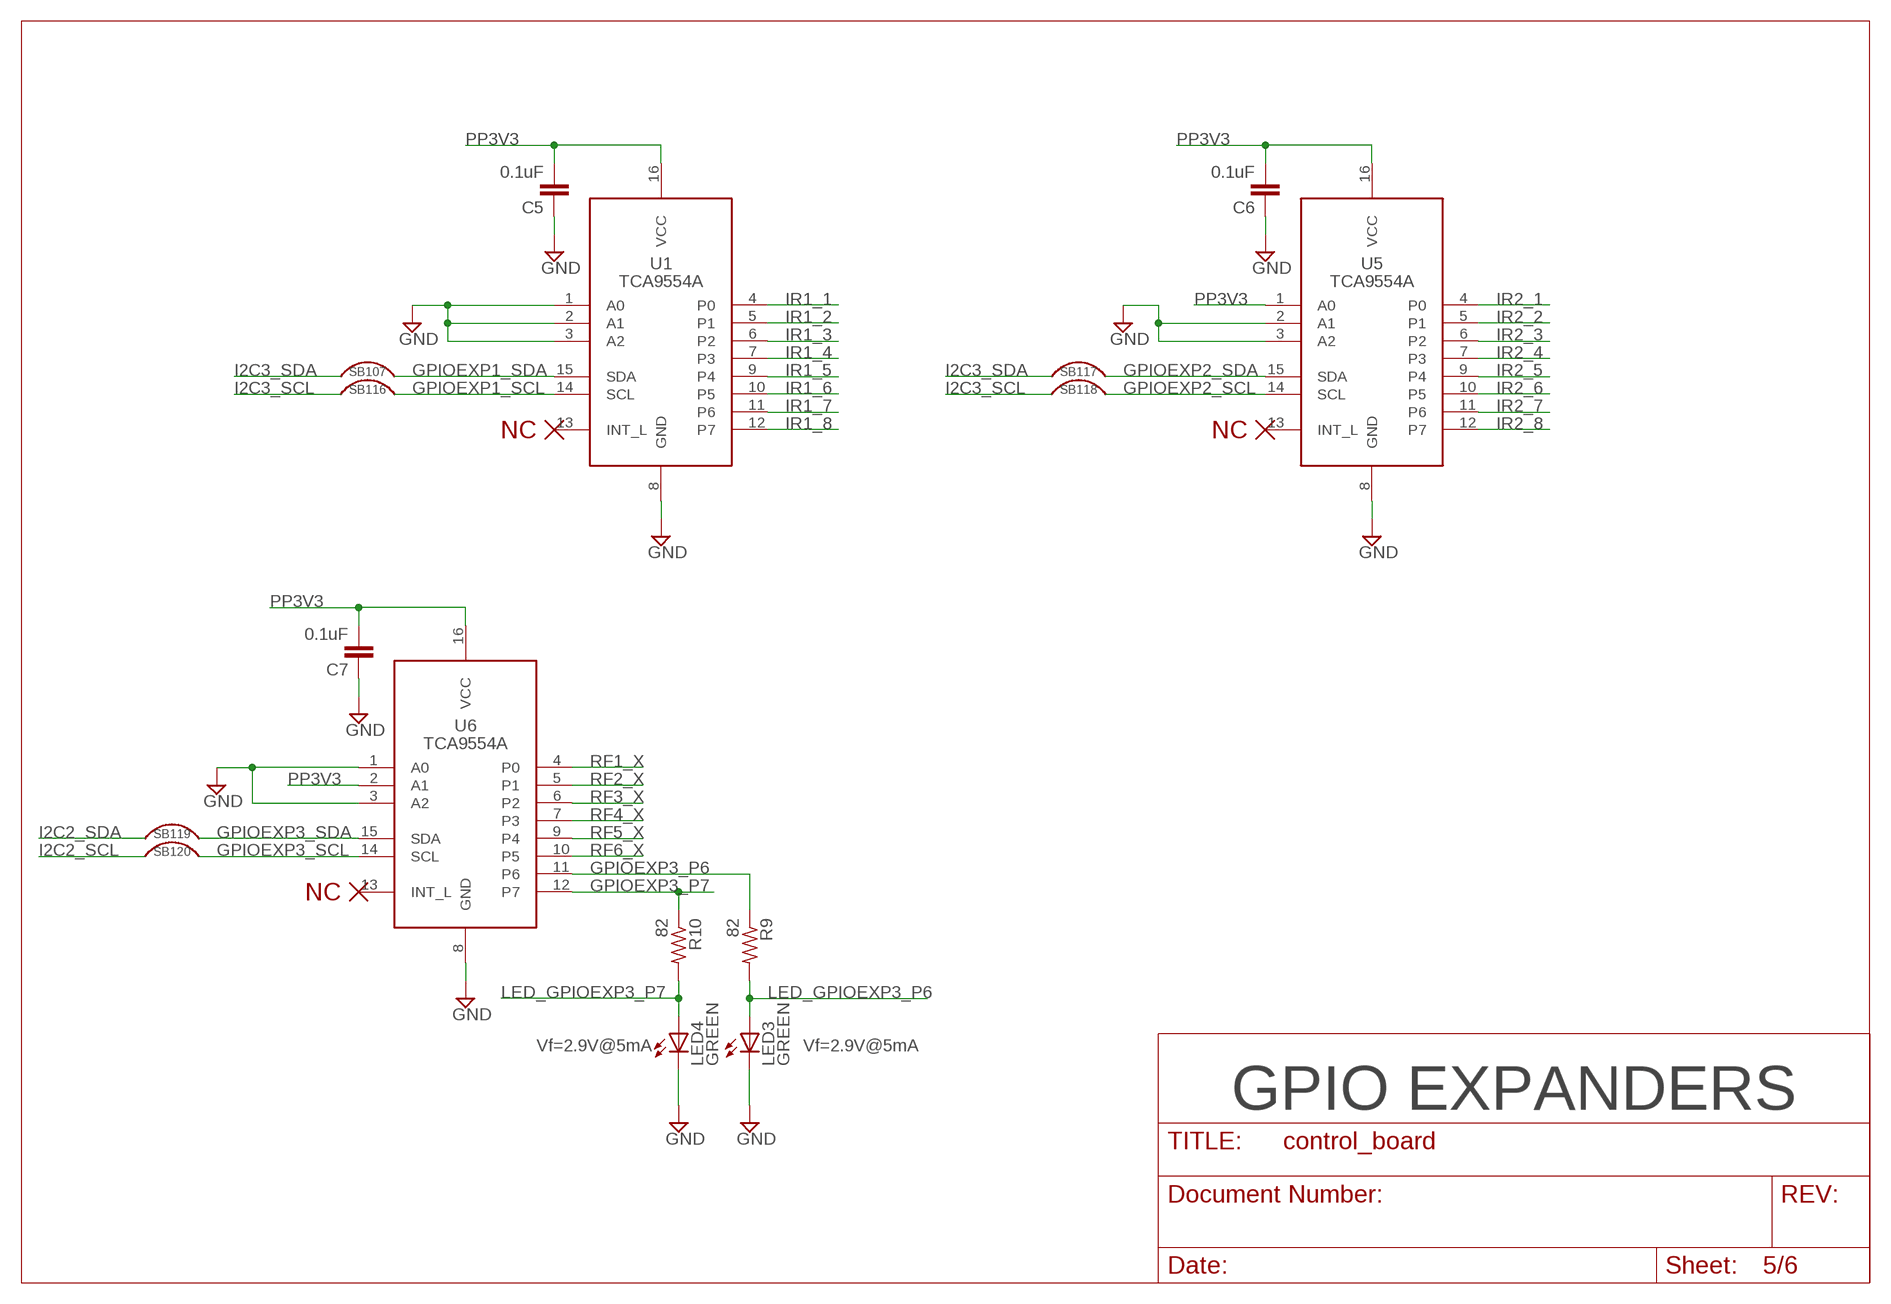
[diagram p4: schematic, sheet 5]

### Parts
C5  0.1uF  C-EUC0603  [C0603]
C6  0.1uF  C-EUC0603  [C0603]
C7  0.1uF  C-EUC0603  [C0603]
LED3  GREEN  LEDCHIPLED_0805  [CHIPLED_0805]
LED4  GREEN  LEDCHIPLED_0805  [CHIPLED_0805]
R9  82  R-US_R0603  [R0603]
R10  82  R-US_R0603  [R0603]
SB107  SOLDER_BRIDGE  [SOLDER_BRIDGE]
SB116  SOLDER_BRIDGE  [SOLDER_BRIDGE]
SB117  SOLDER_BRIDGE  [SOLDER_BRIDGE]
SB118  SOLDER_BRIDGE  [SOLDER_BRIDGE]
SB119  SOLDER_BRIDGE  [SOLDER_BRIDGE]
SB120  SOLDER_BRIDGE  [SOLDER_BRIDGE]
U1  TCA9554A  [SOIC16-1.27-10.2X7.5MM]
U5  TCA9554A  [SOIC16-1.27-10.2X7.5MM]
U6  TCA9554A  [SOIC16-1.27-10.2X7.5MM]
U$1  NC  (no package)
U$30  NC  (no package)
U$31  NC  (no package)

### Nets
GND: C5.1 C6.1 C7.1 LED3.C LED4.C U1.1(A0) U1.2(A1) U1.3(A2) U1.8(GND) U5.2(A1) U5.3(A2) U5.8(GND) U6.1(A0) U6.3(A2) U6.8(GND) ; also sheet 1,2,3,4,6
GPIOEXP1_SCL: SB116.P$2 U1.14(SCL)
GPIOEXP1_SDA: SB107.P$2 U1.15(SDA)
GPIOEXP2_SCL: SB118.P$2 U5.14(SCL)
GPIOEXP2_SDA: SB117.P$2 U5.15(SDA)
GPIOEXP3_P6: R9.1 U6.11(P6)
GPIOEXP3_P7: R10.1 U6.12(P7)
GPIOEXP3_SCL: SB120.P$2 U6.14(SCL)
GPIOEXP3_SDA: SB119.P$2 U6.15(SDA)
I2C2_SCL: SB120.P$1 ; also sheet 2,4
I2C2_SDA: SB119.P$1 ; also sheet 2,4
I2C3_SCL: SB116.P$1 SB118.P$1 ; also sheet 2,4
I2C3_SDA: SB107.P$1 SB117.P$1 ; also sheet 2,4
IR1_1: U1.4(P0) ; also sheet 4
IR1_2: U1.5(P1) ; also sheet 4
IR1_3: U1.6(P2) ; also sheet 4
IR1_4: U1.7(P3) ; also sheet 4
IR1_5: U1.9(P4) ; also sheet 4
IR1_6: U1.10(P5) ; also sheet 4
IR1_7: U1.11(P6) ; also sheet 4
IR1_8: U1.12(P7) ; also sheet 4
IR2_1: U5.4(P0) ; also sheet 4
IR2_2: U5.5(P1) ; also sheet 4
IR2_3: U5.6(P2) ; also sheet 4
IR2_4: U5.7(P3) ; also sheet 4
IR2_5: U5.9(P4) ; also sheet 4
IR2_6: U5.10(P5) ; also sheet 4
IR2_7: U5.11(P6) ; also sheet 4
IR2_8: U5.12(P7) ; also sheet 4
LED_GPIOEXP3_P6: LED3.A R9.2
LED_GPIOEXP3_P7: LED4.A R10.2
N$40: U1.13(INT_L) U$30.P$1
N$41: U5.13(INT_L) U$1.P$1
N$42: U6.13(INT_L) U$31.P$1
PP3V3: C5.2 C6.2 C7.2 U1.16(VCC) U5.1(A0) U5.16(VCC) U6.2(A1) U6.16(VCC) ; also sheet 1,3,4
RF1_X: U6.4(P0) ; also sheet 4
RF2_X: U6.5(P1) ; also sheet 4
RF3_X: U6.6(P2) ; also sheet 4
RF4_X: U6.7(P3) ; also sheet 4
RF5_X: U6.9(P4) ; also sheet 4
RF6_X: U6.10(P5) ; also sheet 4

### Notes on the sheet
- Vf=2.9V@5mA | Vf=2.9V@5mA
- GPIO EXPANDERS

## Sheet 6 of 6: Motor Drivers
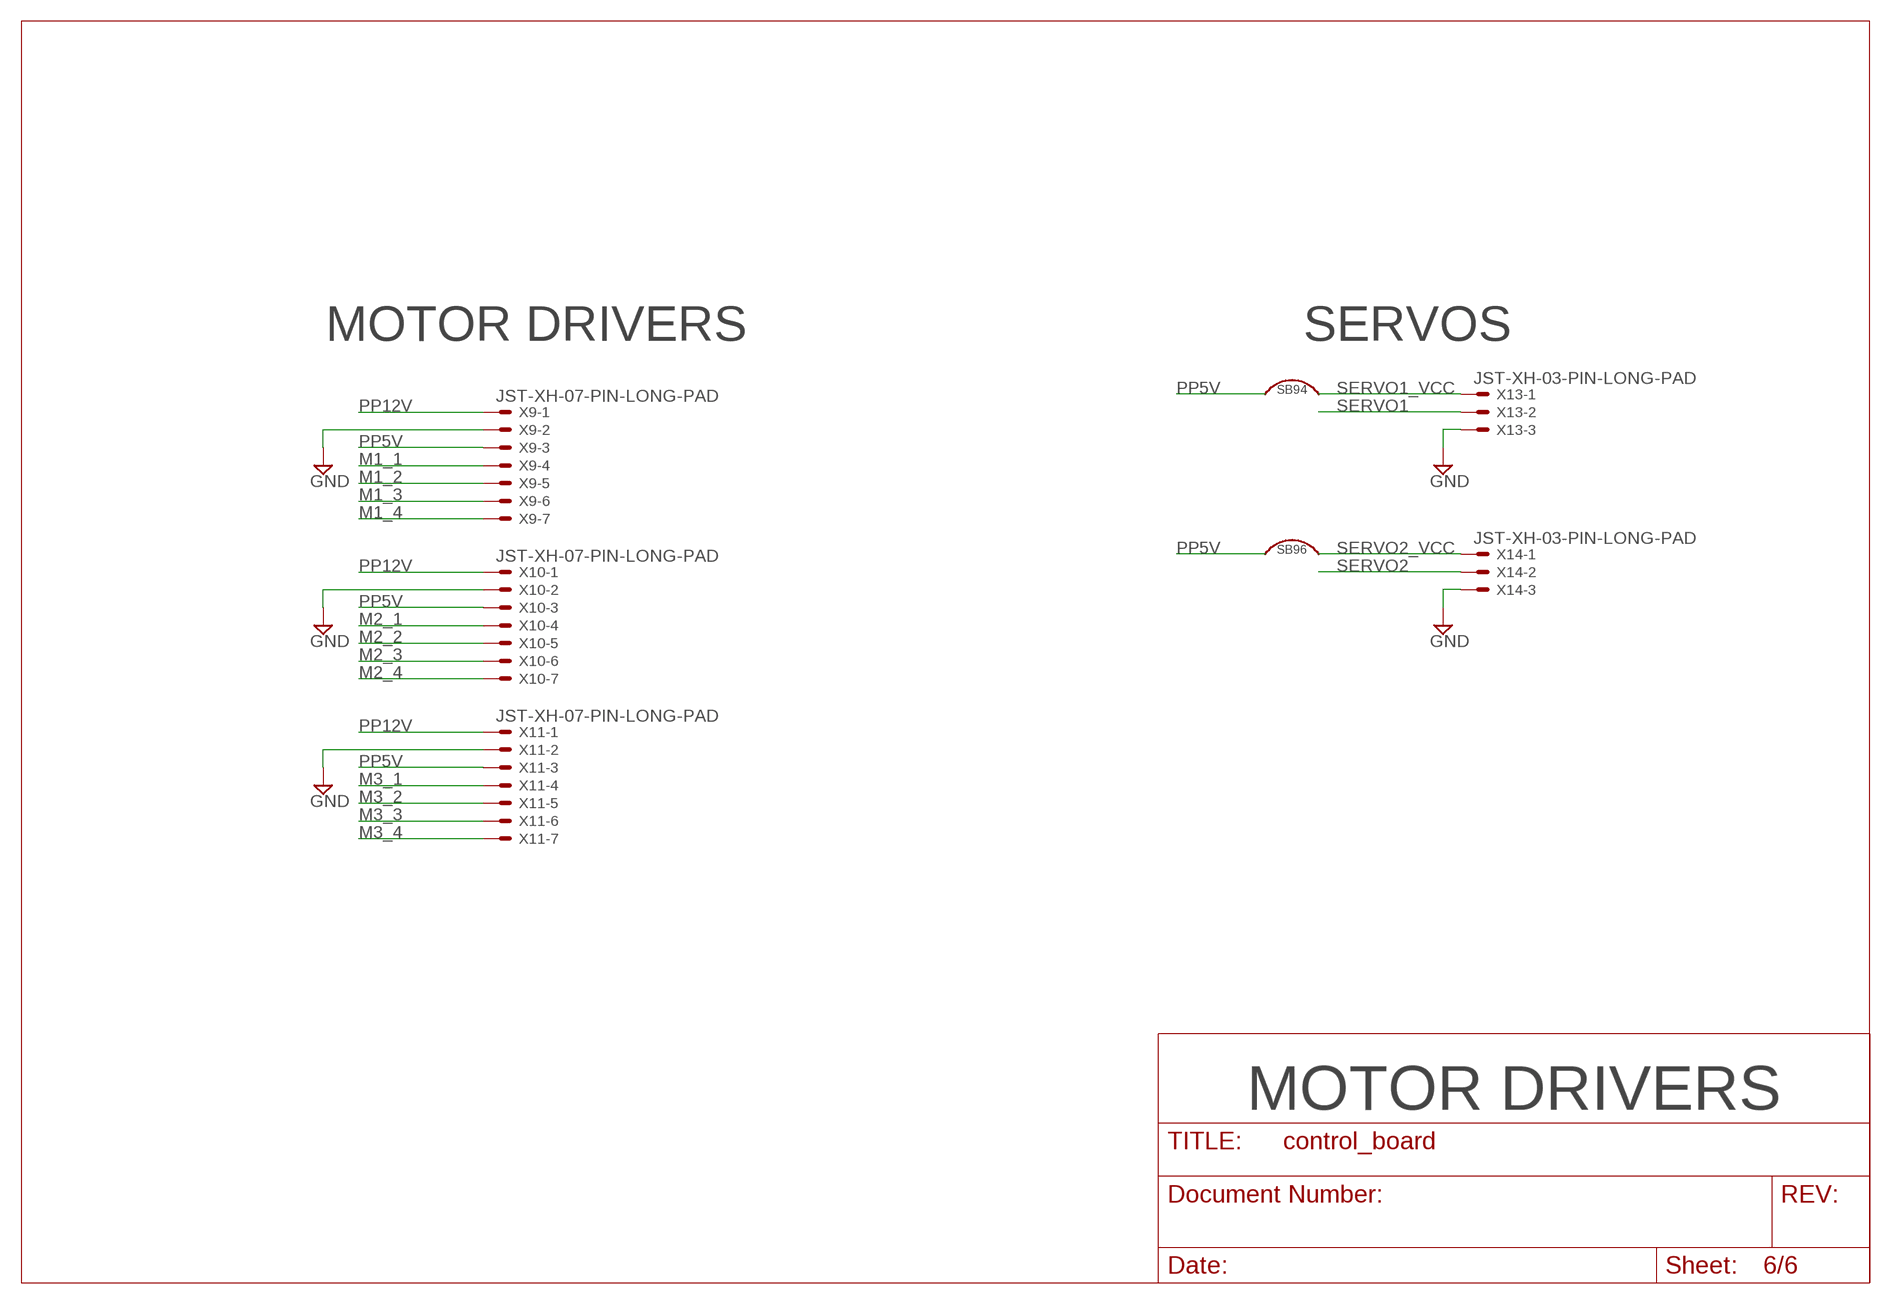
[diagram p5: schematic, sheet 6]

### Parts
SB94  SOLDER_BRIDGE  [SOLDER_BRIDGE]
SB96  SOLDER_BRIDGE  [SOLDER_BRIDGE]
X9  JST-XH-07-PIN-LONG-PAD  [JST-XH-07-PACKAGE-LONG-PAD]
X10  JST-XH-07-PIN-LONG-PAD  [JST-XH-07-PACKAGE-LONG-PAD]
X11  JST-XH-07-PIN-LONG-PAD  [JST-XH-07-PACKAGE-LONG-PAD]
X13  JST-XH-03-PIN-LONG-PAD  [JST-XH-03-PACKAGE-LONG-PAD]
X14  JST-XH-03-PIN-LONG-PAD  [JST-XH-03-PACKAGE-LONG-PAD]

### Nets
GND: X9.2 X10.2 X11.2 X13.3 X14.3 ; also sheet 1,2,3,4,5
M1_1: X9.4 ; also sheet 2
M1_2: X9.5 ; also sheet 2
M1_3: X9.6 ; also sheet 2
M1_4: X9.7 ; also sheet 2
M2_1: X10.4 ; also sheet 2
M2_2: X10.5 ; also sheet 2
M2_3: X10.6 ; also sheet 2
M2_4: X10.7 ; also sheet 2
M3_1: X11.4 ; also sheet 2
M3_2: X11.5 ; also sheet 2
M3_3: X11.6 ; also sheet 2
M3_4: X11.7 ; also sheet 2
PP5V: SB94.P$1 SB96.P$1 X9.3 X10.3 X11.3 ; also sheet 1,3
PP12V: X9.1 X10.1 X11.1 ; also sheet 1
SERVO1: X13.2 ; also sheet 2
SERVO1_VCC: SB94.P$2 X13.1
SERVO2: X14.2 ; also sheet 2
SERVO2_VCC: SB96.P$2 X14.1

### Notes on the sheet
- MOTOR DRIVERS | SERVOS
- MOTOR DRIVERS

## Library data of the parts
C1-C11 = rcl:C-EU: CAPACITOR, European symbol
LED1-LED6 = adafruit:LED: LED OSRAM: - CHIPLED LG R971, LG N971, LY N971, LG Q971, LY Q971, LO R971, LY R971 LH N974, LH R974 LS Q976, LO Q976, LY Q976 LO Q996 - Hyper CHIPLED LW Q18S LB Q993, LB Q99A, LB R99A - SideLED LS A670, LO A670, LY A670, LG A670, LP A670 LB A673, LV A673, LT A673, LW A673 LH A674 LY A675 LS A676, LA A676, LO A676, LY A676, LW A676 LS A679, LY A679, LG A679 - Hyper Micro SIDELED® LS Y876, LA Y876, LO Y876, LY Y876 LT Y87S - SmartLED LW L88C, LW L88S LB L89C, LB L89S, LG L890 LS L89K, LO L89K, LY L89K LS L896, LA L896, LO L896, LY L896 - TOPLED LS T670, LO T670, LY T670, LG T670, LP T670 LSG T670, LSP T670, LSY T670, LOP T670, LYG T670 LG T671, LOG T671, LSG T671 LB T673, LV T673, LT T673, LW T673 LH T674 LS T676, LA T676, LO T676, LY T676, LB T676, LH T676, LSB T676, LW T676 LB T67C, LV T67C, LT T67C, LS T67K, LO T67K, LY T67K, LW E67C LS E67B, LA E67B, LO E67B, LY E67B, LB E67C, LV E67C, LT E67C LW T67C LS T679, LY T679, LG T679 LS T770, LO T770, LY T770, LG T770, LP T770 LB T773, LV T773, LT T773, LW T773 LH T774 LS E675, LA E675, LY E675, LS T675 LS T776, LA T776, LO T776, LY T776, LB T776 LHGB T686 LT T68C, LB T68C - Hyper Mini TOPLED® LB M676 - Mini TOPLED Santana® LG M470 LS M47K, LO M47K, LY M47K Source: http://www.osram.convergy.de/; DIGI: 732-4971-1-ND
PAD1-PAD10 = wirepad:WIREPAD: Wire PAD connect wire on PCB
Q1 Q2 = custom:RE1C002UN: Logic-level N-FET, 20V, 200 mA; DIGI: RE1C002UNTCLCT-ND
R1-R22 = rcl:R-US_: RESISTOR, American symbol
SB1-SB52 SB54-SB73 SB75-SB78 SB80-SB83 SB94 SB96 SB98-SB120 = custom:SOLDER_BRIDGE: Solder bridge with knife-cuttable prebridged connection.
SW1 SW2 = adafruit:SPST_TACT: SMT 6mm switch, EVQQ2 series http://www.ladyada.net/library/eagle; DIGI: P12955SCT-ND
U1 U5 U6 = custom:TCA9554A: I2C 8-bit GPIO Expander; DIGI: 296-45456-1-ND
U2 U7 = custom:AZ1085C: AZ1085C Adjustable 3A LDO, 1.3V drop out; DIGI: AZ1085CD-ADJTRG1DICT-ND
U4 = custom:NUCLEO
U$1-U$40 = custom:NC
X1 X12 X16 X18-X20 = con-jst-xh:JST-XH-02-PIN: JST XH Connector 2 Pin Wire to board connector. Pitch: 2,54 mm, (0.100") Number of pins: 2 Created by Rembrandt Electronics www.rembrandtelectronics.com
X2-X7 = con-jst-xh:JST-XH-06-PIN: JST XH Connector 2 Pin Wire to board connector. Pitch: 2,54 mm, (0.100") Number of pins: 6 Created by Rembrandt Electronics www.rembrandtelectronics.com
X8 = con-jst-xh:JST-XH-04-PIN: JST XH Connector 2 Pin Wire to board connector. Pitch: 2,54 mm, (0.100") Number of pins: 4 Created by Rembrandt Electronics www.rembrandtelectronics.com
X9-X11 = con-jst-xh:JST-XH-07-PIN: JST XH Connector 2 Pin Wire to board connector. Pitch: 2,54 mm, (0.100") Number of pins: 7 Created by Rembrandt Electronics www.rembrandtelectronics.com
X13 X14 = con-jst-xh:JST-XH-03-PIN: JST XH Connector 2 Pin Wire to board connector. Pitch: 2,54 mm, (0.100") Number of pins: 3 Created by Rembrandt Electronics www.rembrandtelectronics.com
X15 X17 = con-jst-xh:JST-XH-08-PIN: JST XH Connector 2 Pin Wire to board connector. Pitch: 2,54 mm, (0.100") Number of pins: 8 Created by Rembrandt Electronics www.rembrandtelectronics.com

## Board
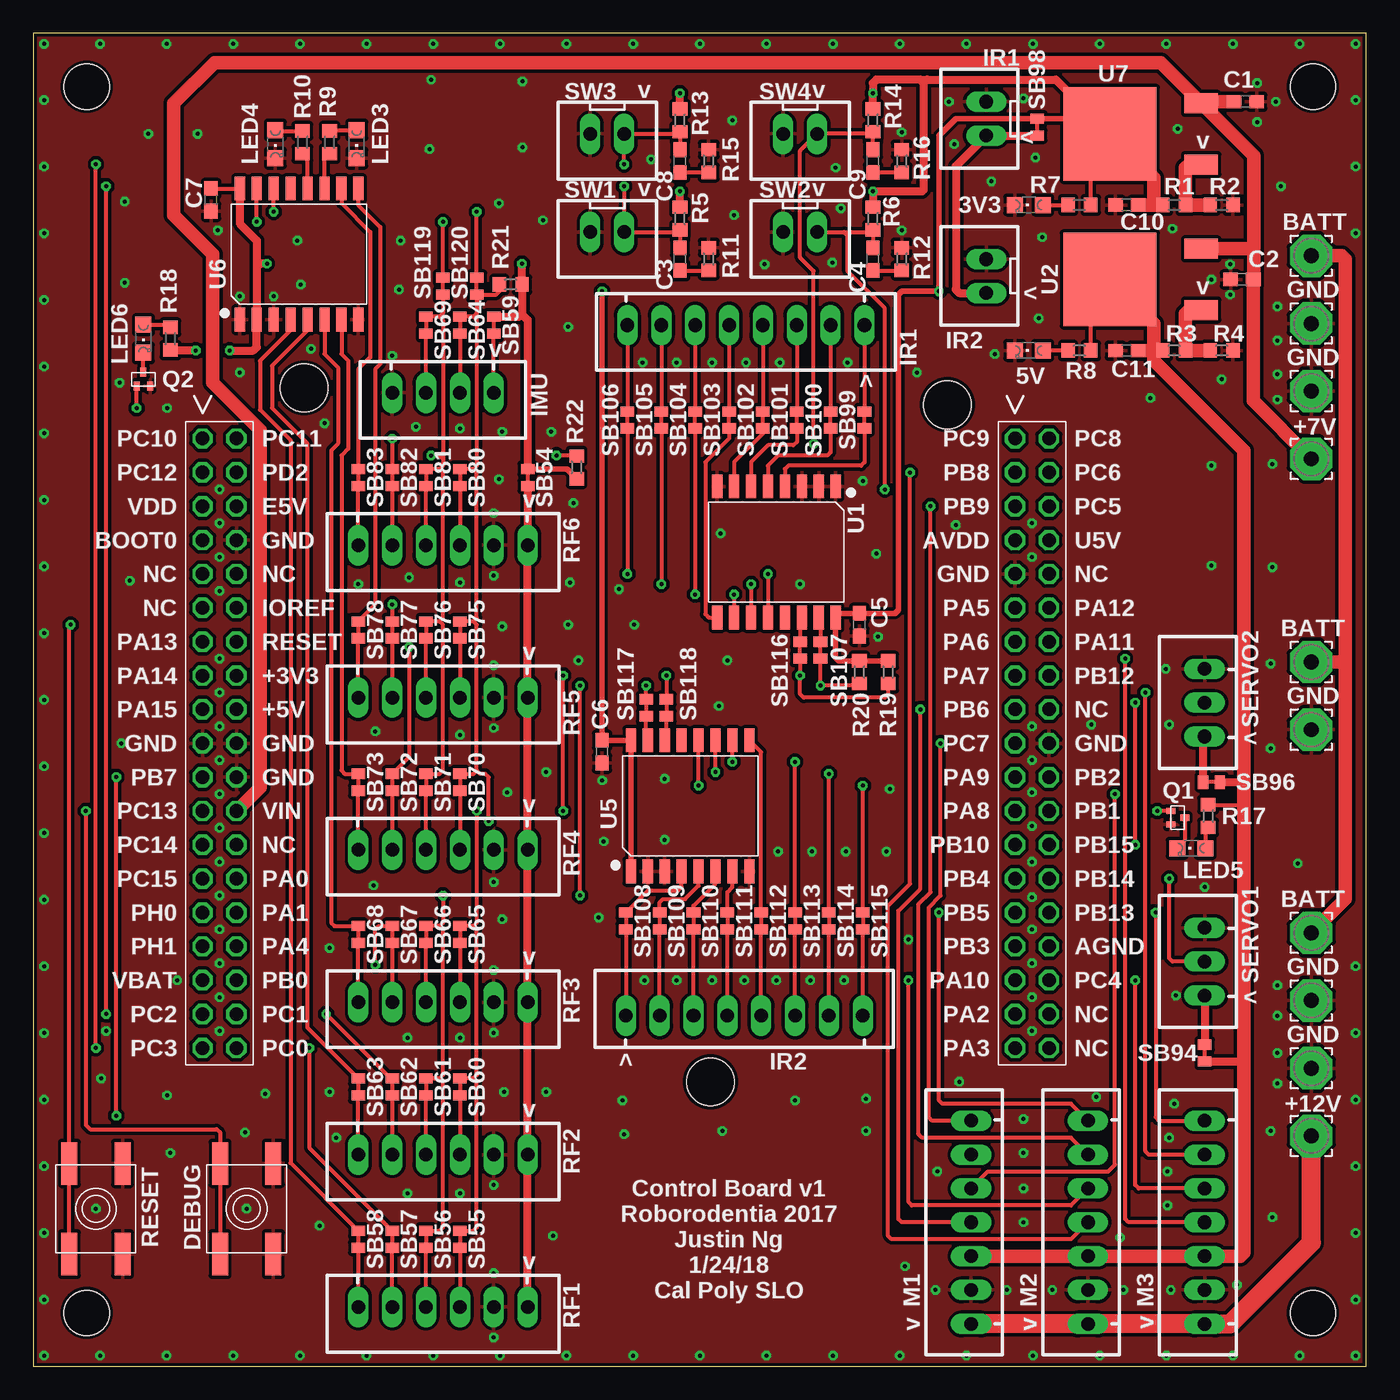
[diagram p6: board, top side]
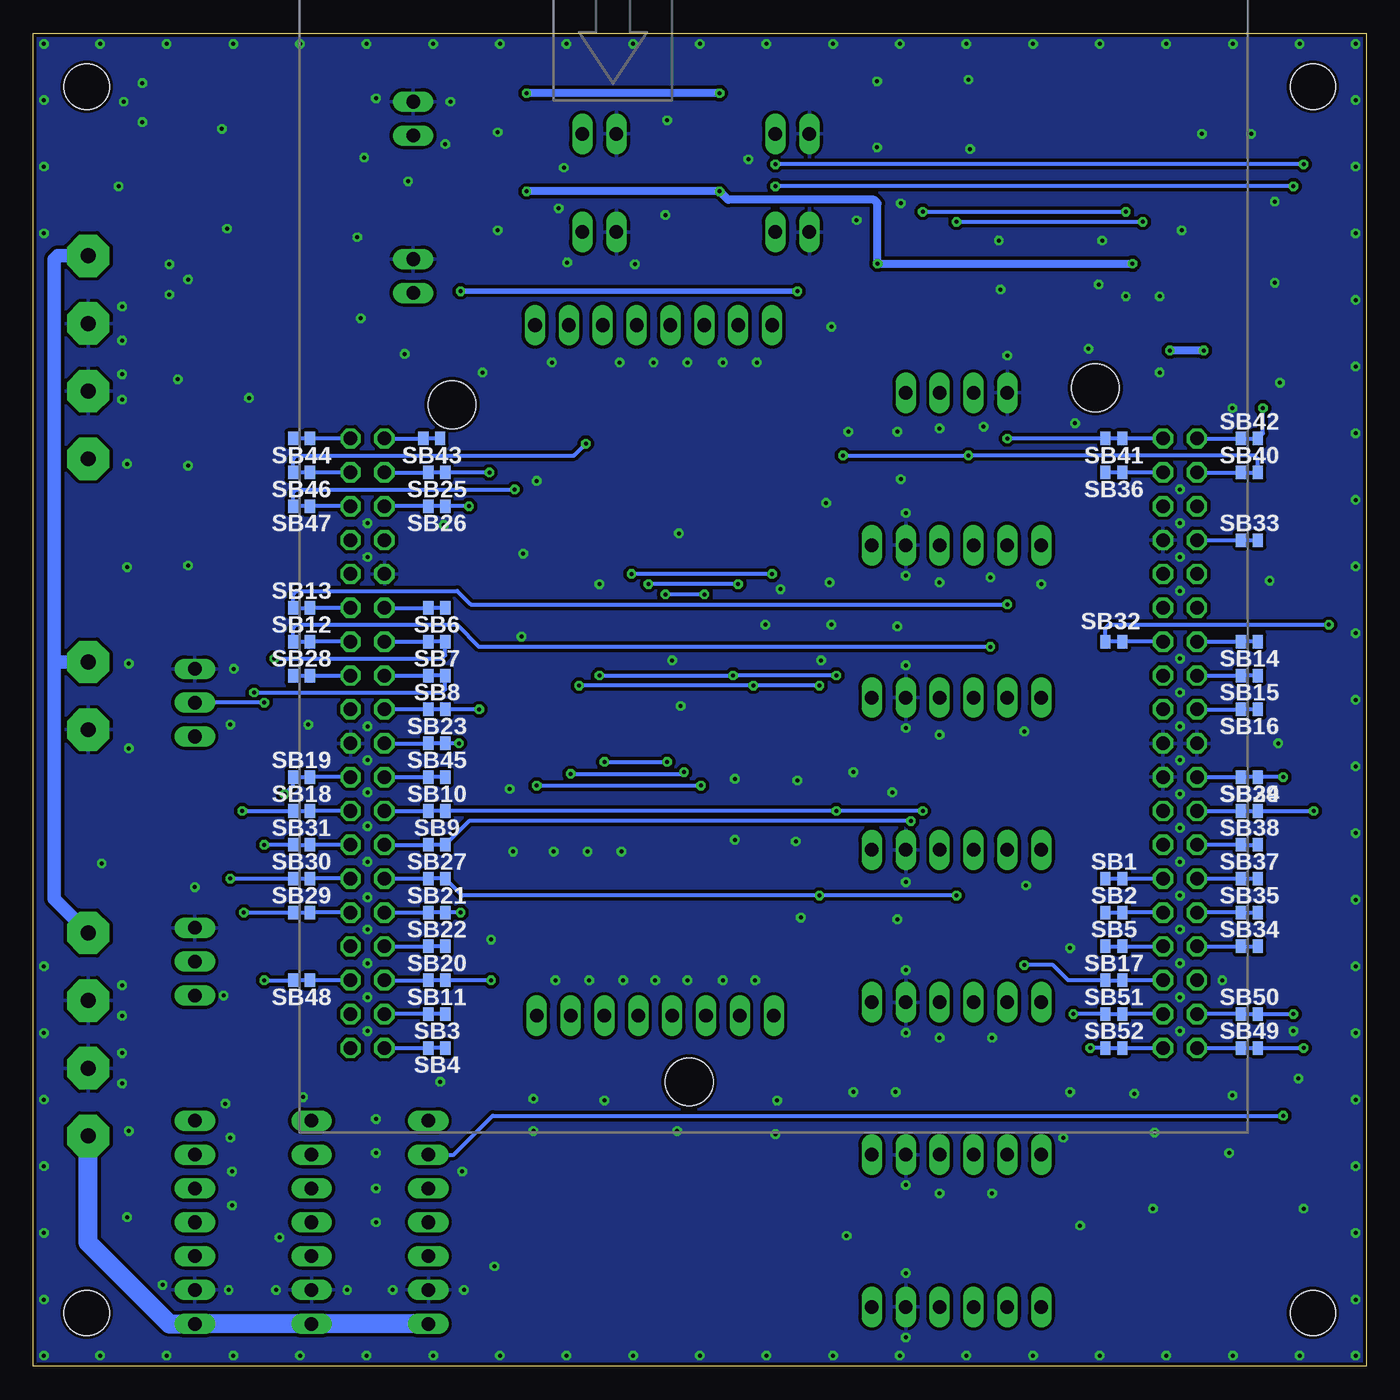
[diagram p7: board, bottom side, seen from below]

Size 100 x 100 mm. Coordinates in mm from the lower left corner, seen from the top.
Outline: 0,0 100,0 100,100 0,100 0,0
Copper layers (1*16): Top 0.035559375mm / dielectric 1.52888125mm / Bottom 0.035559375mm
Design rules "default *": minimum track width 6mil, minimum drill 0.3mm, track to track 8mil, track to pad 8mil, pad to pad 8mil, via to via 8mil, smd to smd 8mil, copper to edge 10mil, drill to drill 8mil, minimum pad ring 10mil, minimum via ring 8mil, stop-mask expansion 4mil, vias tented up to drill 0mil, thermal gap 10mil
Holes 3.4 mm at 4,4 96,4 96,96 4,96

### Footprints (pad centres in the part's own frame; a part is rotated, then mirrored left to right if it is on the bottom)
C0603 = smd 1.1 x 1: 1 -0.85,0; 2 0.85,0
CHIPLED_0805 = smd 1.2 x 1.2: A 0,-1.05; C 0,1.05
3,17/1,1 = drill 1.118 pad 3.175 octagon: 1 0,0
SOT416FL = smd 0.457 x 0.66: P$1 0,0; P$2 1.016,0; P$3 0.508,1.041
R0603 = smd 1 x 1.1: 1 -0.85,0; 2 0.85,0
SOLDER_BRIDGE = smd 0.762 x 1.016: P$1 -0.635,0; P$2 0.635,0
EVQ-Q2 = smd 3.2 x 1.2: A -3.4,-2; A' 3.4,-2; B -3.4,2; B' 3.4,2
SOIC16-1.27-10.2X7.5MM = smd 0.762 x 1.778: 1 -4.445,-4.915; 2 -3.175,-4.915; 3 -1.905,-4.915; 4 -0.635,-4.915; 5 0.635,-4.915; 6 1.905,-4.915; 7 3.175,-4.915; 8 4.445,-4.915; 9 4.445,4.915; 10 3.175,4.915; 11 1.905,4.915; 12 0.635,4.915; 13 -0.635,4.915; 14 -1.905,4.915; 15 -3.175,4.915; 16 -4.445,4.915
TO252 = smd 1.5 x 2.5: 1 -2.3,-6.85; 3 2.3,-6.85 | smd 7 x 7: 2 0,0
NUCLEO = drill 1.016 octagon: P$1 0,0; P$2 2.54,0; P$3 0,-2.54; P$4 2.54,-2.54; P$5 0,-5.08; P$6 2.54,-5.08; P$7 0,-7.62; P$8 2.54,-7.62; P$9 0,-10.16; P$10 2.54,-10.16; P$11 0,-12.7; P$12 2.54,-12.7; P$13 0,-15.24; P$14 2.54,-15.24; P$15 0,-17.78; P$16 2.54,-17.78; P$17 0,-20.32; P$18 2.54,-20.32; P$19 0,-22.86; P$20 2.54,-22.86; P$21 0,-25.4; P$22 2.54,-25.4; P$23 0,-27.94; P$24 2.54,-27.94; P$25 0,-30.48; P$26 2.54,-30.48; P$27 0,-33.02; P$28 2.54,-33.02; P$29 0,-35.56; P$30 2.54,-35.56; P$31 0,-38.1; P$32 2.54,-38.1; P$33 0,-40.64; P$34 2.54,-40.64; P$35 0,-43.18; P$36 2.54,-43.18; P$37 0,-45.72; P$38 2.54,-45.72; P$39 60.96,0; P$40 63.5,0; P$41 60.96,-2.54; P$42 63.5,-2.54; P$43 60.96,-5.08; P$44 63.5,-5.08; P$45 60.96,-7.62; P$46 63.5,-7.62; P$47 60.96,-10.16; P$48 63.5,-10.16; P$49 60.96,-12.7; P$50 63.5,-12.7; P$51 60.96,-15.24; P$52 63.5,-15.24; P$53 60.96,-17.78; P$54 63.5,-17.78; P$55 60.96,-20.32; P$56 63.5,-20.32; P$57 60.96,-22.86; P$58 63.5,-22.86; P$59 60.96,-25.4; P$60 63.5,-25.4; P$61 60.96,-27.94; P$62 63.5,-27.94; P$63 60.96,-30.48; P$64 63.5,-30.48; P$65 60.96,-33.02; P$66 63.5,-33.02; P$67 60.96,-35.56; P$68 63.5,-35.56; P$69 60.96,-38.1; P$70 63.5,-38.1; P$71 60.96,-40.64; P$72 63.5,-40.64; P$73 60.96,-43.18; P$74 63.5,-43.18; P$75 60.96,-45.72; P$76 63.5,-45.72 | hole 3.6: 38.1,-48.26; 7.62,3.81; 55.88,2.54
JST-XH-02-PACKAGE-LONG-PAD = drill 1.016 long: 1 -1.27,0; 2 1.27,0
JST-XH-06-PACKAGE-LONG-PAD = drill 1.016 long: 1 -6.35,0; 2 -3.81,0; 3 -1.27,0; 4 1.27,0; 5 3.81,0; 6 6.35,0
JST-XH-04-PACKAGE-LONG-PAD = drill 1.016 long: 1 -3.81,0; 2 -1.27,0; 3 1.27,0; 4 3.81,0
JST-XH-07-PACKAGE-LONG-PAD = drill 1.016 long: 1 -7.62,0; 2 -5.08,0; 3 -2.54,0; 4 0,0; 5 2.54,0; 6 5.08,0; 7 7.62,0
JST-XH-03-PACKAGE-LONG-PAD = drill 1.016 long: 1 -2.54,0; 2 0,0; 3 2.54,0
JST-XH-08-PACKAGE-LONG-PAD = drill 1.016 long: 1 -8.89,0; 2 -6.35,0; 3 -3.81,0; 4 -1.27,0; 5 1.27,0; 6 3.81,0; 7 6.35,0; 8 8.89,0

### Placement (x,y rotation side)
C1  90.93,94.87 0 top
C2  90.68,81.53 180 top
C3  48.51,83.06 90 top
C4  62.99,83.06 90 top
C5  61.98,55.63 90 top
C6  42.67,46.1 90 top
C7  13.34,87.5 90 top
C8  48.51,90.42 90 top
C9  62.99,90.42 90 top
C10  82.04,87.12 180 top
C11  82.04,76.2 180 top
LED1  74.68,87.12 90 top
LED2  74.68,76.2 90 top
LED3  24.26,91.69 180 top
LED4  18.16,91.69 180 top
LED5  86.87,38.86 90 top
LED6  8.26,77.09 180 top
PAD1  95.89,17.27 180 top
PAD2  95.89,22.35 180 top
PAD3  95.89,27.43 180 top
PAD4  95.89,32.51 180 top
PAD5  95.89,68.07 180 top
PAD6  95.89,73.15 180 top
PAD7  95.89,78.23 180 top
PAD8  95.89,83.31 180 top
PAD9  95.89,52.83 0 top
PAD10  95.89,47.75 0 top
Q1  85.34,41.66 270 top
Q2  7.75,73.53 0 top
R1  85.6,87.12 0 top
R2  89.15,87.12 0 top
R3  85.6,76.2 0 top
R4  89.15,76.2 0 top
R5  48.51,86.11 90 top
R6  62.99,86.11 90 top
R7  78.49,87.12 180 top
R8  78.49,76.2 180 top
R9  22.23,91.82 90 top
R10  20.19,91.82 90 top
R11  50.67,83.06 270 top
R12  65.15,83.06 270 top
R13  48.51,93.47 90 top
R14  62.99,93.47 90 top
R15  50.67,90.42 270 top
R16  65.15,90.42 270 top
R17  88.14,41.27 270 top
R18  10.29,77.09 90 top
R19  64.14,52.07 270 top
R20  61.98,52.07 270 top
R21  35.81,81.15 180 top
R22  40.77,67.44 90 top
SB1  18.92,36.58 0 bottom
SB2  18.92,34.04 0 bottom
SB3  69.72,26.42 180 bottom
SB4  69.72,23.88 180 bottom
SB5  18.92,31.5 0 bottom
SB6  69.72,56.9 180 bottom
SB7  69.72,54.36 180 bottom
SB8  69.72,51.82 180 bottom
SB9  69.72,41.66 180 bottom
SB10  69.72,44.2 180 bottom
SB11  69.72,28.96 180 bottom
SB12  79.88,54.36 0 bottom
SB13  79.88,56.9 0 bottom
SB14  8.76,54.36 180 bottom
SB15  8.76,51.82 180 bottom
SB16  8.76,49.28 180 bottom
SB17  18.92,28.96 0 bottom
SB18  79.88,41.66 0 bottom
SB19  79.88,44.2 0 bottom
SB20  69.72,31.5 180 bottom
SB21  69.72,36.58 180 bottom
SB22  69.72,34.04 180 bottom
SB23  69.72,49.28 180 bottom
SB24  8.76,44.2 180 bottom
SB25  69.72,67.06 180 bottom
SB26  69.72,64.52 180 bottom
SB27  69.72,39.12 180 bottom
SB28  79.88,51.82 0 bottom
SB29  79.88,34.04 0 bottom
SB30  79.88,36.58 0 bottom
SB31  79.88,39.12 0 bottom
SB32  18.92,54.36 180 bottom
SB33  8.76,61.98 0 bottom
SB34  8.76,31.5 0 bottom
SB35  8.76,34.04 0 bottom
SB36  18.92,67.06 180 bottom
SB37  8.76,36.58 0 bottom
SB38  8.76,39.12 0 bottom
SB39  8.76,41.66 0 bottom
SB40  8.76,67.06 0 bottom
SB41  18.92,69.6 180 bottom
SB42  8.76,69.6 0 bottom
SB43  70.1,69.6 180 bottom
SB44  79.88,69.6 180 bottom
SB45  69.72,46.74 180 bottom
SB46  79.88,67.06 180 bottom
SB47  79.88,64.52 180 bottom
SB48  79.88,28.96 180 bottom
SB49  8.76,23.88 0 bottom
SB50  8.76,26.42 0 bottom
SB51  18.92,26.42 0 bottom
SB52  18.92,23.88 0 bottom
SB54  37.08,66.67 270 top
SB55  32,9.53 270 top
SB56  29.46,9.53 270 top
SB57  26.92,9.53 270 top
SB58  24.38,9.53 270 top
SB59  34.54,78.11 270 top
SB60  32,20.95 270 top
SB61  29.46,20.95 270 top
SB62  26.92,20.95 270 top
SB63  24.38,20.95 270 top
SB64  32,78.11 270 top
SB65  32,32.38 270 top
SB66  29.46,32.38 270 top
SB67  26.92,32.38 270 top
SB68  24.38,32.38 270 top
SB69  29.46,78.11 270 top
SB70  32,43.81 270 top
SB71  29.46,43.81 270 top
SB72  26.92,43.81 270 top
SB73  24.38,43.81 270 top
SB75  32,55.24 270 top
SB76  29.46,55.24 270 top
SB77  26.92,55.24 270 top
SB78  24.38,55.24 270 top
SB80  32,66.67 270 top
SB81  29.46,66.67 270 top
SB82  26.92,66.67 270 top
SB83  24.38,66.67 270 top
SB94  87.88,23.5 90 top
SB96  88.39,43.81 180 top
SB98  75.31,92.96 270 top
SB99  62.36,70.99 90 top
SB100  59.82,70.99 90 top
SB101  57.28,70.99 90 top
SB102  54.74,70.99 90 top
SB103  52.2,70.99 90 top
SB104  49.66,70.99 90 top
SB105  47.12,70.99 90 top
SB106  44.58,70.99 90 top
SB107  59.05,53.72 90 top
SB108  44.45,33.4 270 top
SB109  46.99,33.4 270 top
SB110  49.53,33.4 270 top
SB111  52.07,33.4 270 top
SB112  54.61,33.4 270 top
SB113  57.15,33.4 270 top
SB114  59.69,33.4 270 top
SB115  62.23,33.4 270 top
SB116  57.53,53.72 90 top
SB117  45.97,49.4 270 top
SB118  47.5,49.4 270 top
SB119  30.73,81.03 90 top
SB120  33.27,81.03 90 top
SW1  4.7,11.81 270 top
SW2  16,11.81 270 top
U1  55.75,61.09 180 top
U2  80.77,81.53 90 top
U4  12.7,69.6 0 top
U5  49.28,42.04 0 top
U6  19.94,83.44 0 top
U7  80.77,92.46 90 top
X1  43.05,85.09 180 top
X2  30.73,4.45 180 top
X3  30.73,15.88 180 top
X4  30.73,27.3 180 top
X5  30.73,38.73 180 top
X6  30.73,50.16 180 top
X7  30.73,61.59 180 top
X8  30.73,73.03 180 top
X9  70.36,10.79 90 top
X10  79.12,10.79 90 top
X11  87.88,10.79 90 top
X12  57.53,85.09 180 top
X13  87.88,30.35 90 top
X14  87.88,49.78 90 top
X15  53.47,78.11 180 top
X16  71.5,93.6 90 top
X17  53.34,26.29 0 top
X18  71.5,81.79 90 top
X19  43.05,92.46 180 top
X20  57.53,92.46 180 top

### Tracks (layer width: path | path; a pad name or v marks a point on that pad's centre or on a via)
BOOT0_CONN
  Bottom 0.305: U4.P$7 SB33.P$1
BRD_BUTTN
  Bottom 0.305: U4.P$23 SB39.P$1
BRD_LED
  Bottom 0.305: U4.P$49 SB6.P$2
DBG_BUTTON  (via drill 0.3)
  Top 0.305: SW2.A' SW2.A 14,17.53 13.75,17.78 4.26,17.78 3.94,18.1 v3.94,41.66
  Bottom 0.305: SB39.P$2 v3.94,41.66
GND  (via drill 0.3)
  other vias: 18.03,80.26 15.49,80.26 32,24.64 5.08,21.59 5.46,25.15 67.82,14.61 74.3,16 74.3,18.54 74.3,13.34 74.3,10.79 15.49,74.55 20.83,76.33 32,70.36 32,58.8 24.38,58.67 59.94,82.8 61.09,75.31 60.2,89.92 69.09,91.69 60.58,86.87 32,47.37 65.66,32 0.8,5 0.8,10 0.8,15 0.8,20 0.8,95 0.8,90 0.8,85 0.8,80 0.8,75 0.8,70 0.8,65 0.8,60 0.8,55 0.8,50 0.8,45 0.8,40 0.8,35 0.8,30 0.8,25 0.8,0.8 95,99.2 90,99.2 85,99.2 80,99.2 5,99.2 10,99.2 15,99.2 20,99.2 25,99.2 30,99.2 35,99.2 40,99.2 45,99.2 50,99.2 55,99.2 60,99.2 65,99.2 70,99.2 75,99.2 0.8,99.2 95,0.8 90,0.8 85,0.8 80,0.8 5,0.8 10,0.8 15,0.8 20,0.8 25,0.8 30,0.8 35,0.8 40,0.8 45,0.8 50,0.8 55,0.8 60,0.8 65,0.8 70,0.8 75,0.8 99.2,0.8 99.2,5 99.2,10 99.2,15 99.2,20 99.2,95 99.2,90 99.2,85 99.2,30 99.2,25 99.2,99.2 65.15,85.22 65.15,92.58 91.82,96.27 91.82,93.34 93.22,94.87 88.39,81.53 89.79,82.68 89.79,80.39 93.34,79.5 93.34,76.96 93.34,74.42 93.34,72.52 93.34,28.57 93.34,26.29 93.34,23.5 93.34,21.21 42.67,43.94 63.37,54.74 13.84,85.22 67.69,5.71 73.03,5.71 76.45,5.71 81.79,5.71 85.34,5.71 90.3,6.1 34.54,6.99 34.54,2.16 34.54,13.59 34.54,25.02 34.54,29.72 34.54,36.32 34.54,47.88 34.54,52.58 34.54,59.31 34.54,64.01 26.92,75.82 13.97,63.25 13.97,60.71 13.97,48.01 13.97,45.47 13.97,42.93 4.7,11.81 16,11.81 74.93,48.01 74.93,45.47 74.93,60.71 8.64,92.46 12.32,92.46 29.72,91.31 34.92,87.25 38.23,85.98 40.13,77.98 38.86,70.1 35.18,70.1 28.7,70.48 34.92,66.55 40.51,64.77 40.13,55.63 45.09,55.63 43.94,58.29 35.18,55.5 40.26,58.8 25.65,47.62 38.48,44.58 42.8,39.37 47.37,44.07 47.37,39.5 51.44,49.53 64.26,43.31 58.42,38.61 55.88,38.61 60.96,38.61 64.01,38.61 42.42,33.66 35.18,33.53 25.53,36.07 22.23,31.37 28.07,24.64 35.31,20.57 38.48,20.57 38.99,9.78 28.07,12.95 22.73,17.14 15.88,17.53 22.23,20.57 17.4,20.45 21.46,10.54 10.03,20.32 10.29,16 10.79,28.96 6.6,46.74 7.24,58.93 10.03,71.88 6.48,73.79 6.86,87.38 19.81,84.45 20.07,81.15 27.43,80.77 27.56,84.45 46.35,90.55 52.58,86.36 52.45,93.47 71.88,88.9 85.85,92.84 85.47,85.34 75.44,78.61 93.6,88.52 89.15,74.04 83.82,72.64 72.14,75.95 88.39,67.56 92.96,67.69 88.39,60.07 92.96,59.94 92.84,52.7 92.84,46.35 85.22,48.13 84.96,52.32 79.38,48.13 74.93,43.05 74.93,40.51 74.93,37.85 74.93,35.18 74.93,32.77 74.93,30.23 74.93,27.69 74.93,25.15 85.72,27.81 74.93,63.25 13.97,65.79 13.97,58.17 13.97,53.09 13.97,50.55 13.97,40.39 13.97,37.85 13.97,35.31 13.97,32.77 13.97,30.23 13.97,27.69 13.97,25.15 35.56,43.05 69.47,21.34 79.76,20.19 85.6,19.68 85.22,17.14 85.09,14.61 85.09,12.06 81.53,9.65 92.96,11.18 92.84,17.65 62.48,17.65 62.48,20.07 51.69,17.65 44.2,19.94 44.32,17.4 65.41,7.49 87.88,35.94 94.87,37.72 69.22,63.12 63.25,60.96 51.56,62.48 62.23,66.42 57.53,58.67 75.69,84.71 75.18,90.68 66.29,74.55 21.84,70.74 28.19,59.18 45.72,75.31 48.26,75.31 50.93,75.31 53.47,75.31 56.01,75.31 54.86,82.68 52.07,52.96 40.89,52.96 45.85,28.96 48.26,28.96 50.93,28.96 53.34,28.96 55.75,28.96 58.29,28.96 60.83,28.96 57.15,19.94 68.71,94.87 74.3,95.12 36.7,91.44 29.84,96.52 36.7,96.39 6.86,81.28 32,12.95
  pour Top (isolate 0.254): 0.13,99.95 99.95,99.95 99.95,0 0.13,0
  pour Bottom (isolate 0.254): 99.95,99.95 0.13,99.95 0.13,0 99.95,0
GPIOEXP1_SCL
  Top 0.305: U1.14 57.53,56.05 SB116.P$2
GPIOEXP1_SDA
  Top 0.305: U1.15 59.05,56.05 SB107.P$2
GPIOEXP2_SCL
  Top 0.305: U5.14 47.5,46.95 SB118.P$2
GPIOEXP2_SDA
  Top 0.305: U5.15 45.97,46.95 SB117.P$2
GPIOEXP3_P6
  Top 0.305: U6.11 21.84,90.72 22.1,90.97 R9.1
GPIOEXP3_P7
  Top 0.305: U6.12 20.57,90.72 20.32,90.97 R10.1
GPIOEXP3_SCL  (via drill 0.3)
  Top 0.305: SB120.P$2 v33.27,86.61 | v18.03,86.61 U6.14
  Bottom 0.305: v33.27,86.61 v18.03,86.61
GPIOEXP3_SDA  (via drill 0.3)
  Top 0.305: SB119.P$2 v30.73,85.85 | v16.76,85.85 U6.15
  Bottom 0.305: v30.73,85.85 v16.76,85.85
I2C2_SCL  (via drill 0.3)
  Top 0.305: 33.02,78.74 33.27,78.49 33.27,67.56 33.02,67.31 | 33.02,55.88 33.27,56.13 33.27,67.06 33.02,67.31 | 33.02,67.31 SB80.P$1 | SB70.P$1 33.02,44.45 33.27,44.7 | 33.27,44.7 33.27,55.63 33.02,55.88 | 33.02,55.88 SB75.P$1 | 33.02,78.74 33.27,78.99 SB120.P$1 34.71,80.39 34.96,80.64 R21.2 | 33.02,78.74 SB64.P$1 | v34.16,40.89 34.16,44.2 33.91,44.45 33.53,44.45 33.27,44.7
  Bottom 0.305: SB27.P$1 67.31,40.89 v34.16,40.89
I2C2_SDA  (via drill 0.3)
  Top 0.305: 30.48,78.74 30.73,78.49 30.73,68.58 | 30.73,68.58 30.73,68.07 | 30.48,67.31 30.73,67.56 30.73,68.07 | 30.48,55.88 30.73,56.13 30.73,67.06 30.48,67.31 | 30.48,67.31 SB81.P$1 | SB71.P$1 30.48,44.45 30.73,44.7 30.73,55.63 30.48,55.88 | 30.48,55.88 SB76.P$1 | 30.48,78.74 30.73,78.99 SB119.P$1 | 30.48,78.74 SB69.P$1 | 30.48,68.33 30.73,68.07 | v29.84,68.33 30.48,68.33 | 30.48,68.33 30.73,68.58 | R22.2 40.73,68.33 v39.24,68.33
  Bottom 0.305: SB40.P$2 8.13,68.07 8.38,68.33 v29.84,68.33 v39.24,68.33
I2C3_SCL  (via drill 0.3)
  Top 0.305: SB55.P$1 33.02,10.16 33.27,10.41 33.27,21.34 33.02,21.59 | 33.02,21.59 33.27,21.84 33.27,32.77 33.02,33.02 | 33.02,21.59 SB60.P$1 | SB116.P$1 v57.53,51.82 57.53,50.42 57.78,50.16 63.88,50.16 64.14,50.42 R19.2 | v47.5,51.82 SB118.P$1 | v33.27,41.66 33.27,33.27 33.02,33.02 | 33.02,33.02 SB65.P$1 | v39.75,41.66 v39.75,51.82
  Bottom 0.305: v57.53,51.82 v47.5,51.82 v39.75,51.82 | v33.27,41.66 v39.75,41.66 SB9.P$1
I2C3_SDA  (via drill 0.3)
  Top 0.305: 30.1,21.59 SB61.P$1 30.48,21.59 | SB56.P$1 30.48,10.16 30.73,10.41 30.73,21.34 30.48,21.59 | 30.48,21.59 30.73,21.84 30.73,32.77 30.48,33.02 | SB117.P$1 v45.97,51.05 | SB107.P$1 v59.05,51.05 61.81,51.05 R20.2 | v30.73,35.31 30.73,33.27 30.48,33.02 | 30.48,33.02 SB66.P$1 | v41.02,35.31 v41.02,51.05
  Bottom 0.305: v59.05,51.05 v45.97,51.05 v41.02,51.05 | SB21.P$1 67.82,35.31 v41.02,35.31 v30.73,35.31
IMU_SCL
  Top 0.305: SB64.P$2 X8.2
IMU_SDA
  Top 0.305: X8.3 SB69.P$2
IMU_VCC
  Top 0.305: X8.1 SB59.P$2
IR1_1
  Top 0.305: SB99.P$1 62.36,67.82 62.1,67.56 56.64,67.56 56.39,67.31 U1.4
IR1_2
  Top 0.305: SB100.P$1 59.82,68.58 59.56,68.33 55.88,68.33 55.12,67.56 U1.5
IR1_3
  Top 0.305: SB101.P$1 57.28,69.34 57.02,69.09 55.12,69.09 53.85,67.82 U1.6
IR1_4
  Top 0.305: SB102.P$1 54.74,69.98 52.58,67.82 U1.7
IR1_5
  Top 0.305: SB103.P$1 52.2,69.6 50.42,67.82 50.42,56.43 50.67,56.17 U1.9
IR1_6  (via drill 0.3)
  Top 0.305: SB104.P$1 v49.66,57.91 | v52.58,57.91 U1.10
  Bottom 0.305: v49.66,57.91 v52.58,57.91
IR1_7  (via drill 0.3)
  Top 0.305: SB105.P$1 v47.12,58.67 | v53.85,58.67 U1.11
  Bottom 0.305: v47.12,58.67 v53.85,58.67
IR1_8  (via drill 0.3)
  Top 0.305: SB106.P$1 v44.58,59.44 | v55.12,59.44 U1.12
  Bottom 0.305: v44.58,59.44 v55.12,59.44
IR1_IN1
  Top 0.305: X15.1 SB99.P$2
IR1_IN2
  Top 0.305: X15.2 SB100.P$2
IR1_IN3
  Top 0.305: X15.3 SB101.P$2
IR1_IN4
  Top 0.305: X15.4 SB102.P$2
IR1_IN5
  Top 0.305: X15.5 SB103.P$2
IR1_IN6
  Top 0.305: X15.6 SB104.P$2
IR1_IN7
  Top 0.305: X15.7 SB105.P$2
IR1_IN8
  Top 0.305: X15.8 SB106.P$2
IR2_1
  Top 0.305: SB108.P$1 46.1,35.69 48.39,35.69 48.64,35.94 U5.4
IR2_2
  Top 0.305: SB109.P$1 46.99,34.8 47.24,35.05 48.9,35.05 49.91,36.07 U5.5
IR2_3
  Top 0.305: SB110.P$1 49.53,34.54 51.18,36.2 U5.6
IR2_4
  Top 0.305: SB111.P$1 52.07,35.56 52.45,35.94 U5.7
IR2_5
  Top 0.305: SB112.P$1 54.61,46.06 U5.9
IR2_6  (via drill 0.3)
  Top 0.305: SB113.P$1 v57.15,45.34 | v52.45,45.34 U5.10
  Bottom 0.305: v57.15,45.34 v52.45,45.34
IR2_7  (via drill 0.3)
  Top 0.305: SB114.P$1 v59.69,44.45 | v51.18,44.58 U5.11
  Bottom 0.305: v59.69,44.45 51.31,44.45 v51.18,44.58
IR2_8  (via drill 0.3)
  Top 0.305: SB115.P$1 v62.23,43.56 | v49.91,43.56 U5.12
  Bottom 0.305: v62.23,43.56 v49.91,43.56
IR2_IN1
  Top 0.305: SB108.P$2 X17.1
IR2_IN2
  Top 0.305: X17.2 SB109.P$2
IR2_IN3
  Top 0.305: X17.3 SB110.P$2
IR2_IN4
  Top 0.305: X17.4 SB111.P$2
IR2_IN5
  Top 0.305: X17.5 SB112.P$2
IR2_IN6
  Top 0.305: X17.6 SB113.P$2
IR2_IN7
  Top 0.305: X17.7 SB114.P$2
IR2_IN8
  Top 0.305: X17.8 SB115.P$2
IR_VCC
  Top 0.61: SB98.P$2 X16.1 69.22,90.04 69.22,80.77 69.47,80.52 X18.1
LED_3V3
  Top 0.305: LED1.A R7.2
LED_5V
  Top 0.305: R8.2 LED2.A
LED_DBG1  (via drill 0.3)
  Top 0.305: Q1.P$1 v84.33,41.66
  Bottom 0.305: v84.33,41.66 SB18.P$1
LED_DBG1_A
  Top 0.305: 87.88,38.9 LED5.A 87.92,40.2 R17.2
LED_DBG1_K
  Top 0.305: Q1.P$3 86.39,39.43 LED5.C
LED_DBG2  (via drill 0.3)
  Top 0.305: v7.75,71.88 Q2.P$1
  Bottom 0.305: SB42.P$2 7.75,69.98 v7.75,71.88
LED_DBG2_A
  Top 0.305: LED6.A 10.09,78.14 R18.2
LED_DBG2_K
  Top 0.305: Q2.P$3 LED6.C
LED_GPIOEXP3_P6
  Top 0.305: R9.2 22.3,92.74 LED3.A
LED_GPIOEXP3_P7
  Top 0.305: LED4.A 18.23,92.67 R10.2
M1_1  (via drill 0.3)
  Top 0.305: X9.4 65.15,10.79 64.9,11.05 64.9,34.16 66.55,35.81 v66.55,49.28
  Bottom 0.305: v66.55,49.28 SB23.P$1
M1_2  (via drill 0.3)
  Top 0.305: X9.5 71.63,14.61 80.64,14.61 81.15,15.11 v81.15,42.93
  Bottom 0.305: v81.15,42.93 80.52,43.56 SB19.P$1
M1_3  (via drill 0.3)
  Top 0.305: v6.22,18.8 v6.22,44.2
  Bottom 0.305: X9.6 68.45,15.88 65.53,18.8 v6.22,18.8 | v6.22,44.2 SB24.P$1
M1_4  (via drill 0.3)
  Top 0.305: X9.7 67.44,18.41 67.18,18.67 67.18,34.42 68.07,35.31 v68.07,46.74
  Bottom 0.305: v68.07,46.74 SB45.P$1
M2_1  (via drill 0.3)
  Top 0.305: X10.4 77.85,9.53 64.39,9.53 64.14,9.78 64.14,34.54 65.79,36.2 v65.79,67.06
  Bottom 0.305: v65.79,67.06 SB25.P$1
M2_2  (via drill 0.3)
  Top 0.305: v65.66,28.96 65.66,12.32 65.91,12.06 77.85,12.06 X10.5
  Bottom 0.305: v65.66,28.96 SB11.P$1
M2_3  (via drill 0.3)
  Top 0.305: X10.6 77.85,17.14 66.67,17.14 66.42,17.4 66.42,34.67 67.31,35.56 v67.31,64.52
  Bottom 0.305: v67.31,64.52 SB26.P$1
M2_4  (via drill 0.3)
  Top 0.305: v67.94,34.04 67.94,19.94 68.2,19.68 77.85,19.68 X10.7
  Bottom 0.305: v67.94,34.04 SB22.P$1
M3_1  (via drill 0.3)
  Top 0.305: v81.92,53.09 81.92,11.05 82.17,10.79 X11.4
  Bottom 0.305: v81.92,53.09 69.34,53.09 69.09,53.34 SB7.P$1
M3_2  (via drill 0.3)
  Top 0.305: v82.68,28.96 82.68,13.59 82.93,13.34 X11.5
  Bottom 0.305: v82.68,28.96 SB48.P$2
M3_3  (via drill 0.3)
  Top 0.305: v83.44,50.55 83.44,16.13 83.69,15.88 X11.6
  Bottom 0.305: v83.44,50.55 69.34,50.55 69.09,50.8 SB8.P$1
M3_4  (via drill 0.3)
  Top 0.305: v84.2,34.04 84.2,18.67 84.45,18.41 X11.7
  Bottom 0.305: v84.2,34.04 SB29.P$1
N$1
  Top 1.016: U2.1 86.7,79.23 86.45,78.98 R3.2 R4.1
N$3
  Top 1.016: U7.1 86.7,90.16 86.45,89.9 R1.2 R2.1
OSC32_IN
  Bottom 0.305: SB38.P$1 U4.P$25
OSC32_OUT
  Bottom 0.305: U4.P$27 SB37.P$1
OSC_IN
  Bottom 0.305: SB35.P$1 U4.P$29
OSC_OUT
  Bottom 0.305: U4.P$31 SB34.P$1
PA0_CONN
  Bottom 0.305: SB1.P$2 U4.P$28
PA1_CONN
  Bottom 0.305: U4.P$30 SB2.P$2
PA4_CONN
  Bottom 0.305: SB5.P$2 U4.P$32
PA6_CONN
  Bottom 0.305: U4.P$51 SB7.P$2
PA7_CONN
  Bottom 0.305: U4.P$53 SB8.P$2
PA8_CONN
  Bottom 0.305: U4.P$61 SB9.P$2
PA9_CONN
  Bottom 0.305: U4.P$59 SB10.P$2
PA10_CONN
  Bottom 0.305: U4.P$71 SB11.P$2
PA11_CONN
  Bottom 0.305: U4.P$52 SB12.P$2
PA12_CONN
  Bottom 0.305: U4.P$50 SB13.P$2
PA15_CONN
  Bottom 0.305: U4.P$17 SB16.P$2
PB0_CONN
  Bottom 0.305: U4.P$34 SB17.P$2
PB1_CONN
  Bottom 0.305: U4.P$62 SB18.P$2
PB2_CONN
  Bottom 0.305: U4.P$60 SB19.P$2
PB4_CONN
  Bottom 0.305: U4.P$65 SB21.P$2
PB5_CONN
  Bottom 0.305: U4.P$67 SB22.P$2
PB6_CONN
  Bottom 0.305: SB23.P$2 U4.P$55
PB7_CONN
  Bottom 0.305: U4.P$21 SB24.P$2
PB8_CONN
  Bottom 0.305: U4.P$41 SB25.P$2
PB9_CONN
  Bottom 0.305: SB26.P$2 U4.P$43
PB10_CONN
  Bottom 0.305: U4.P$63 SB27.P$2
PB12_CONN
  Bottom 0.305: SB28.P$2 U4.P$54
PB13_CONN
  Bottom 0.305: U4.P$68 SB29.P$2
PB14_CONN
  Bottom 0.305: U4.P$66 SB30.P$2
PB15_CONN
  Bottom 0.305: U4.P$64 SB31.P$2
PC0_CONN
  Bottom 0.305: SB52.P$2 U4.P$38
PC1_CONN
  Bottom 0.305: U4.P$36 SB51.P$2
PC2_CONN
  Bottom 0.305: SB50.P$1 U4.P$35
PC3_CONN
  Bottom 0.305: U4.P$37 SB49.P$1
PC4_CONN
  Bottom 0.305: U4.P$72 SB48.P$1
PC5_CONN
  Bottom 0.305: U4.P$44 SB47.P$1
PC6_CONN
  Bottom 0.305: U4.P$42 SB46.P$1
PC7_CONN
  Bottom 0.305: U4.P$57 SB45.P$2
PC8_CONN
  Bottom 0.305: U4.P$40 SB44.P$1
PC9_CONN
  Bottom 0.305: U4.P$39 SB43.P$2
PC10_CONN
  Bottom 0.305: U4.P$1 SB42.P$1
PC11_CONN
  Bottom 0.305: U4.P$2 SB41.P$1
PC12_CONN
  Bottom 0.305: U4.P$3 SB40.P$1
PD2_CONN
  Bottom 0.305: U4.P$4 SB36.P$1
PP3V3  (via drill 0.3)
  Top 0.305: R7.1 79.34,92.2 79.59,92.46 80.26,92.46 U7.2 80.77,95.5 80.52,95.76 | C7.2 U6.16 | 60.45,56.48 60.2,56.22 U1.16 | C6.2 | 12.15,76.24 v12.19,76.2
  Top 0.406: SB59.P$1 36.83,78.74 | U5.1 U5.16 C6.2 | 60.45,56.48 C5.2 64.64,56.48 64.9,56.73 64.9,80.39 65.15,80.64 v67.94,80.64 67.94,92.33 69.22,93.6 SB98.P$1 80.52,93.6 80.77,93.34 U7.2 | R22.1 40.04,67.31 SB54.P$1 | U1.16 60.2,53.17 60.45,52.92 R20.1 R19.1 | 36.41,78.74 36.66,78.99 | C6.2 v42.67,80.64
  Top 0.61: SB54.P$1 37.08,78.49 36.83,78.74 36.66,78.91 R21.1 v36.66,82.72 | U6.16 15.49,85.72 16.76,84.45 16.76,82.97 | 16.76,82.97 16.76,82.46 | 16.76,82.46 U6.2 16.76,76.45 16.51,76.2 v14.73,76.2 | 79.12,93.6 80.26,92.46 | R5.2 v48.51,88.14 | R6.2 v62.99,88.14 66.67,88.14 66.8,88.27 66.8,96.27 | R13.2 v48.51,95.5 | R14.2 v62.99,95.5 62.99,96.27 63.25,96.52 66.55,96.52 | 66.55,96.52 67.06,96.52 | 66.8,96.27 67.06,96.52 | 66.8,96.27 66.55,96.52 | 67.06,96.52 76.71,96.52 U7.2 | SB59.P$1 36.41,78.74 | R18.1 12.15,76.24 | 17.02,82.72 16.76,82.46 | v17.53,82.72 17.02,82.72 | 17.02,82.72 16.76,82.97
  Top 1.016: R1.1 84.07,87.12 | 84.07,87.12 C10.1 | U7.2 84.07,89.15 84.07,87.12
  Bottom 0.406: v42.67,80.64 v67.94,80.64
  Bottom 0.61: v62.99,88.14 v48.51,88.14 47.88,87.5 36.92,87.5 36.66,87.25 v36.66,82.72 v17.53,82.72 | v48.51,95.5 v62.99,95.5 | v12.19,76.2 v14.73,76.2
PP5V
  Top 0.305: R8.1 79.34,81.28 79.59,81.53 U2.2 | R17.1 90.72,42.12 90.81,42.04
  Top 0.61: SB94.P$1 90.81,22.86 | SB96.P$1 90.81,43.81
  Top 1.016: R3.1 84.07,76.2 | 84.07,76.2 C11.1 | 84.07,76.2 84.07,78.23 U2.2 | 84.07,76.2 84.07,75.44 90.81,68.71 90.81,43.81 90.81,42.04 90.81,22.86 90.81,8.51 90.55,8.26 X11.3 X10.3 X9.3
PP7V
  Top 1.016: U7.3 87.8,94.58 | 87.8,83.65 U2.3 91.32,83.83 91.57,84.09 | U7.3 91.57,90.81 91.57,84.09 | PAD5.1 91.53,72.43 C2.1 91.57,81.58 91.57,84.09 | U7.3 84.59,97.79 13.59,97.79 10.54,94.74 10.54,86.36 13.46,83.44 13.46,73.79 17.02,70.23 17.02,43.43 U4.P$24 | C1.1 87.73,94.87 U7.3
PP12V
  Top 1.422: X9.1 X10.1 X11.1 89.79,3.17 95.89,9.27 PAD1.1
  Bottom 1.422: X9.1 X10.1 X11.1 89.79,3.17 95.89,9.27 PAD1.1
PPBATT
  Top 1.016: PAD4.1 98.42,35.05 98.42,35.43 98.42,52.83 | PAD9.1 98.42,52.83 | PAD8.1 98.17,83.31 98.42,83.06 98.42,52.83
  Bottom 1.016: PAD4.1 98.42,35.05 98.42,83.06 98.17,83.31 PAD8.1 | 98.17,52.83 PAD9.1
RESET_BTN  (via drill 0.3)
  Top 0.305: SW1.A' SW1.A 2.7,55.53 v2.79,55.63
  Bottom 0.305: SB32.P$2 19.56,55.37 19.3,55.63 v2.79,55.63
RESET_CONN
  Bottom 0.305: U4.P$14 SB32.P$1
RF1_G  (via drill 0.3)
  Top 0.305: v20.7,23.88 20.7,16.38 SB57.P$1
  Bottom 0.305: SB52.P$1 v20.7,23.88
RF1_GPIO
  Top 0.305: X2.5 SB57.P$2
RF1_SCL
  Top 0.305: SB55.P$2 X2.3
RF1_SDA
  Top 0.305: X2.4 SB56.P$2
RF1_X
  Top 0.305: SB58.P$1 19.3,15.24 19.3,69.47 17.02,71.75 17.02,75.44 19.3,77.72 U6.4
RF1_XSHUT
  Top 0.305: SB58.P$2 X2.6
RF2_G  (via drill 0.3)
  Top 0.305: v21.97,26.42 26.8,21.59 SB62.P$1
  Bottom 0.305: SB51.P$1 v21.97,26.42
RF2_GPIO
  Top 0.305: SB62.P$2 X3.5
RF2_SCL
  Top 0.305: SB60.P$2 X3.3
RF2_SDA
  Top 0.305: X3.4 SB61.P$2
RF2_X
  Top 0.305: SB63.P$1 20.57,25.4 20.57,69.22 17.91,71.88 17.91,75.06 20.57,77.72 U6.5
RF2_XSHUT
  Top 0.305: X3.6 SB63.P$2
RF3_G  (via drill 0.3)
  Top 0.305: v25.65,30.1 25.65,32.77 25.91,33.02 SB67.P$1
  Bottom 0.305: SB17.P$1 22.35,28.96 23.5,30.1 v25.65,30.1
RF3_GPIO
  Top 0.305: SB67.P$2 X4.5
RF3_SCL
  Top 0.305: SB65.P$2 X4.3
RF3_SDA
  Top 0.305: X4.4 SB66.P$2
RF3_X
  Top 0.305: U6.6 21.84,75.95 22.86,74.93 22.86,69.22 22.35,68.71 22.35,33.27 22.61,33.02 SB68.P$1
RF3_XSHUT
  Top 0.305: X4.6 SB68.P$2
RF4_G  (via drill 0.3)
  Top 0.305: v28.19,53.98 28.19,45.72 SB72.P$1
  Bottom 0.305: SB12.P$1 80.52,55.37 80.26,55.63 68.2,55.63 66.55,53.98 v28.19,53.98
RF4_GPIO
  Top 0.305: SB72.P$2 X5.5
RF4_SCL
  Top 0.305: SB70.P$2 X5.3
RF4_SDA
  Top 0.305: X5.4 SB71.P$2
RF4_X
  Top 0.305: SB73.P$1 23.37,44.45 23.11,44.7 23.11,68.33 23.62,68.83 23.62,75.44 23.11,75.95 U6.7
RF4_XSHUT
  Top 0.305: X5.6 SB73.P$2
RF5_G  (via drill 0.3)
  Top 0.305: v26.92,57.15 SB77.P$1
  Bottom 0.305: SB13.P$1 80.52,57.91 80.26,58.17 68.2,58.17 67.18,57.15 v26.92,57.15
RF5_GPIO
  Top 0.305: SB77.P$2 X6.5
RF5_SCL
  Top 0.305: SB75.P$2 X6.3
RF5_SDA
  Top 0.305: X6.4 SB76.P$2
RF5_X
  Top 0.305: U6.9 24.38,87.12 26.04,85.47 26.04,75.18 25.65,74.8 25.65,57.15 SB78.P$1
RF5_XSHUT
  Top 0.305: X6.6 SB78.P$2
RF6_G  (via drill 0.3)
  Top 0.305: v26.92,69.6 SB82.P$1
  Bottom 0.305: SB41.P$2 v26.92,69.6
RF6_GPIO
  Top 0.305: SB82.P$2 X7.5
RF6_SCL
  Top 0.305: SB80.P$2 X7.3
RF6_SDA
  Top 0.305: X7.4 SB81.P$2
RF6_X
  Top 0.305: U6.10 23.11,87.25 25.27,85.09 25.27,75.69 24.38,74.8 SB83.P$1
RF6_XSHUT
  Top 0.305: X7.6 SB83.P$2
RF_VCC
  Top 0.61: SB54.P$2 X7.1 X6.1 X5.1 X4.1 X3.1 X2.1
SERVO1  (via drill 0.3)
  Top 0.305: X13.2 85.47,30.35 85.22,30.61 v85.22,36.58
  Bottom 0.305: v85.22,36.58 SB30.P$1
SERVO1_VCC
  Top 0.61: X13.1 SB94.P$2
SERVO2  (via drill 0.3)
  Top 0.305: v82.68,39.12 v82.68,49.78
  Bottom 0.305: SB31.P$1 v82.68,39.12 | v82.68,49.78 X14.2
SERVO2_VCC
  Top 0.61: X14.1 87.76,47.12 SB96.P$2
SW1  (via drill 0.3)
  Top 0.305: C3.2 R5.1 arc-90 48.35,85.09 X1.1 v44.32,88.52 | v5.46,26.42 v5.46,88.52
  Bottom 0.305: SB50.P$2 v5.46,26.42 | v5.46,88.52 v44.32,88.52
SW1_ILIM
  Top 0.305: C3.1 R11.2
SW2  (via drill 0.3)
  Top 0.305: X12.1 60.83,85.09 | 60.83,85.09 61.34,85.09 | 61.34,85.09 62.83,85.09 R6.1 C4.2 | 61.09,84.84 60.83,85.09 | 61.09,84.84 61.34,85.09 | v63.88,65.79 63.88,79.38 61.09,82.17 61.09,84.84
  Bottom 0.305: SB47.P$2 80.52,65.53 80.26,65.79 v63.88,65.79
SW2_ILIM
  Top 0.305: C4.1 R12.2
SW3  (via drill 0.3)
  Top 0.305: C8.2 R13.1 arc-90 48.35,92.46 X19.1 v44.32,90.17 | v4.7,23.88 v4.7,90.17
  Bottom 0.305: SB49.P$2 v4.7,23.88 | v4.7,90.17 v44.32,90.17
SW3_ILIM
  Top 0.305: C8.1 R15.2
SW4  (via drill 0.3)
  Top 0.305: C9.2 R14.1 62.83,92.46 X20.1 57.53,91.19 57.53,83.19 58.55,82.17 v58.55,69.22
  Bottom 0.305: SB46.P$2 80.52,68.07 80.26,68.33 59.44,68.33 v58.55,69.22
SW4_ILIM
  Top 0.305: C9.1 R16.2
SWO
  Bottom 0.305: U4.P$69 SB20.P$2
TCK
  Bottom 0.305: U4.P$15 SB15.P$2
TMS
  Bottom 0.305: U4.P$13 SB14.P$2
USART2_RX
  Bottom 0.305: U4.P$75 SB4.P$2
USART2_TX
  Bottom 0.305: SB3.P$2 U4.P$73

### Text on the board
tPlace: IR1 | SW3 | v | SW4 | v | < | v | SW1 | v | SW2 | v | 3V3 | BATT | < | v | GND | IR2 | v | IR1 | GND | > | 5V | IMU | +7V | v | RF6 | BATT | v | SERVO2 | GND | RF5 | < | v | RF4 | BATT | SERVO1 | v | GND | < | RF3 | GND | > | IR2 | +12V | v | RF2 | RESET | DEBUG | Control Board v1 / Roborodentia 2017 / Justin Ng / 1/24/18 / Cal Poly SLO | v | M1 | M2 | M3 | RF1 | v | v | v